# Altium project EMG_shield.PrjPcb
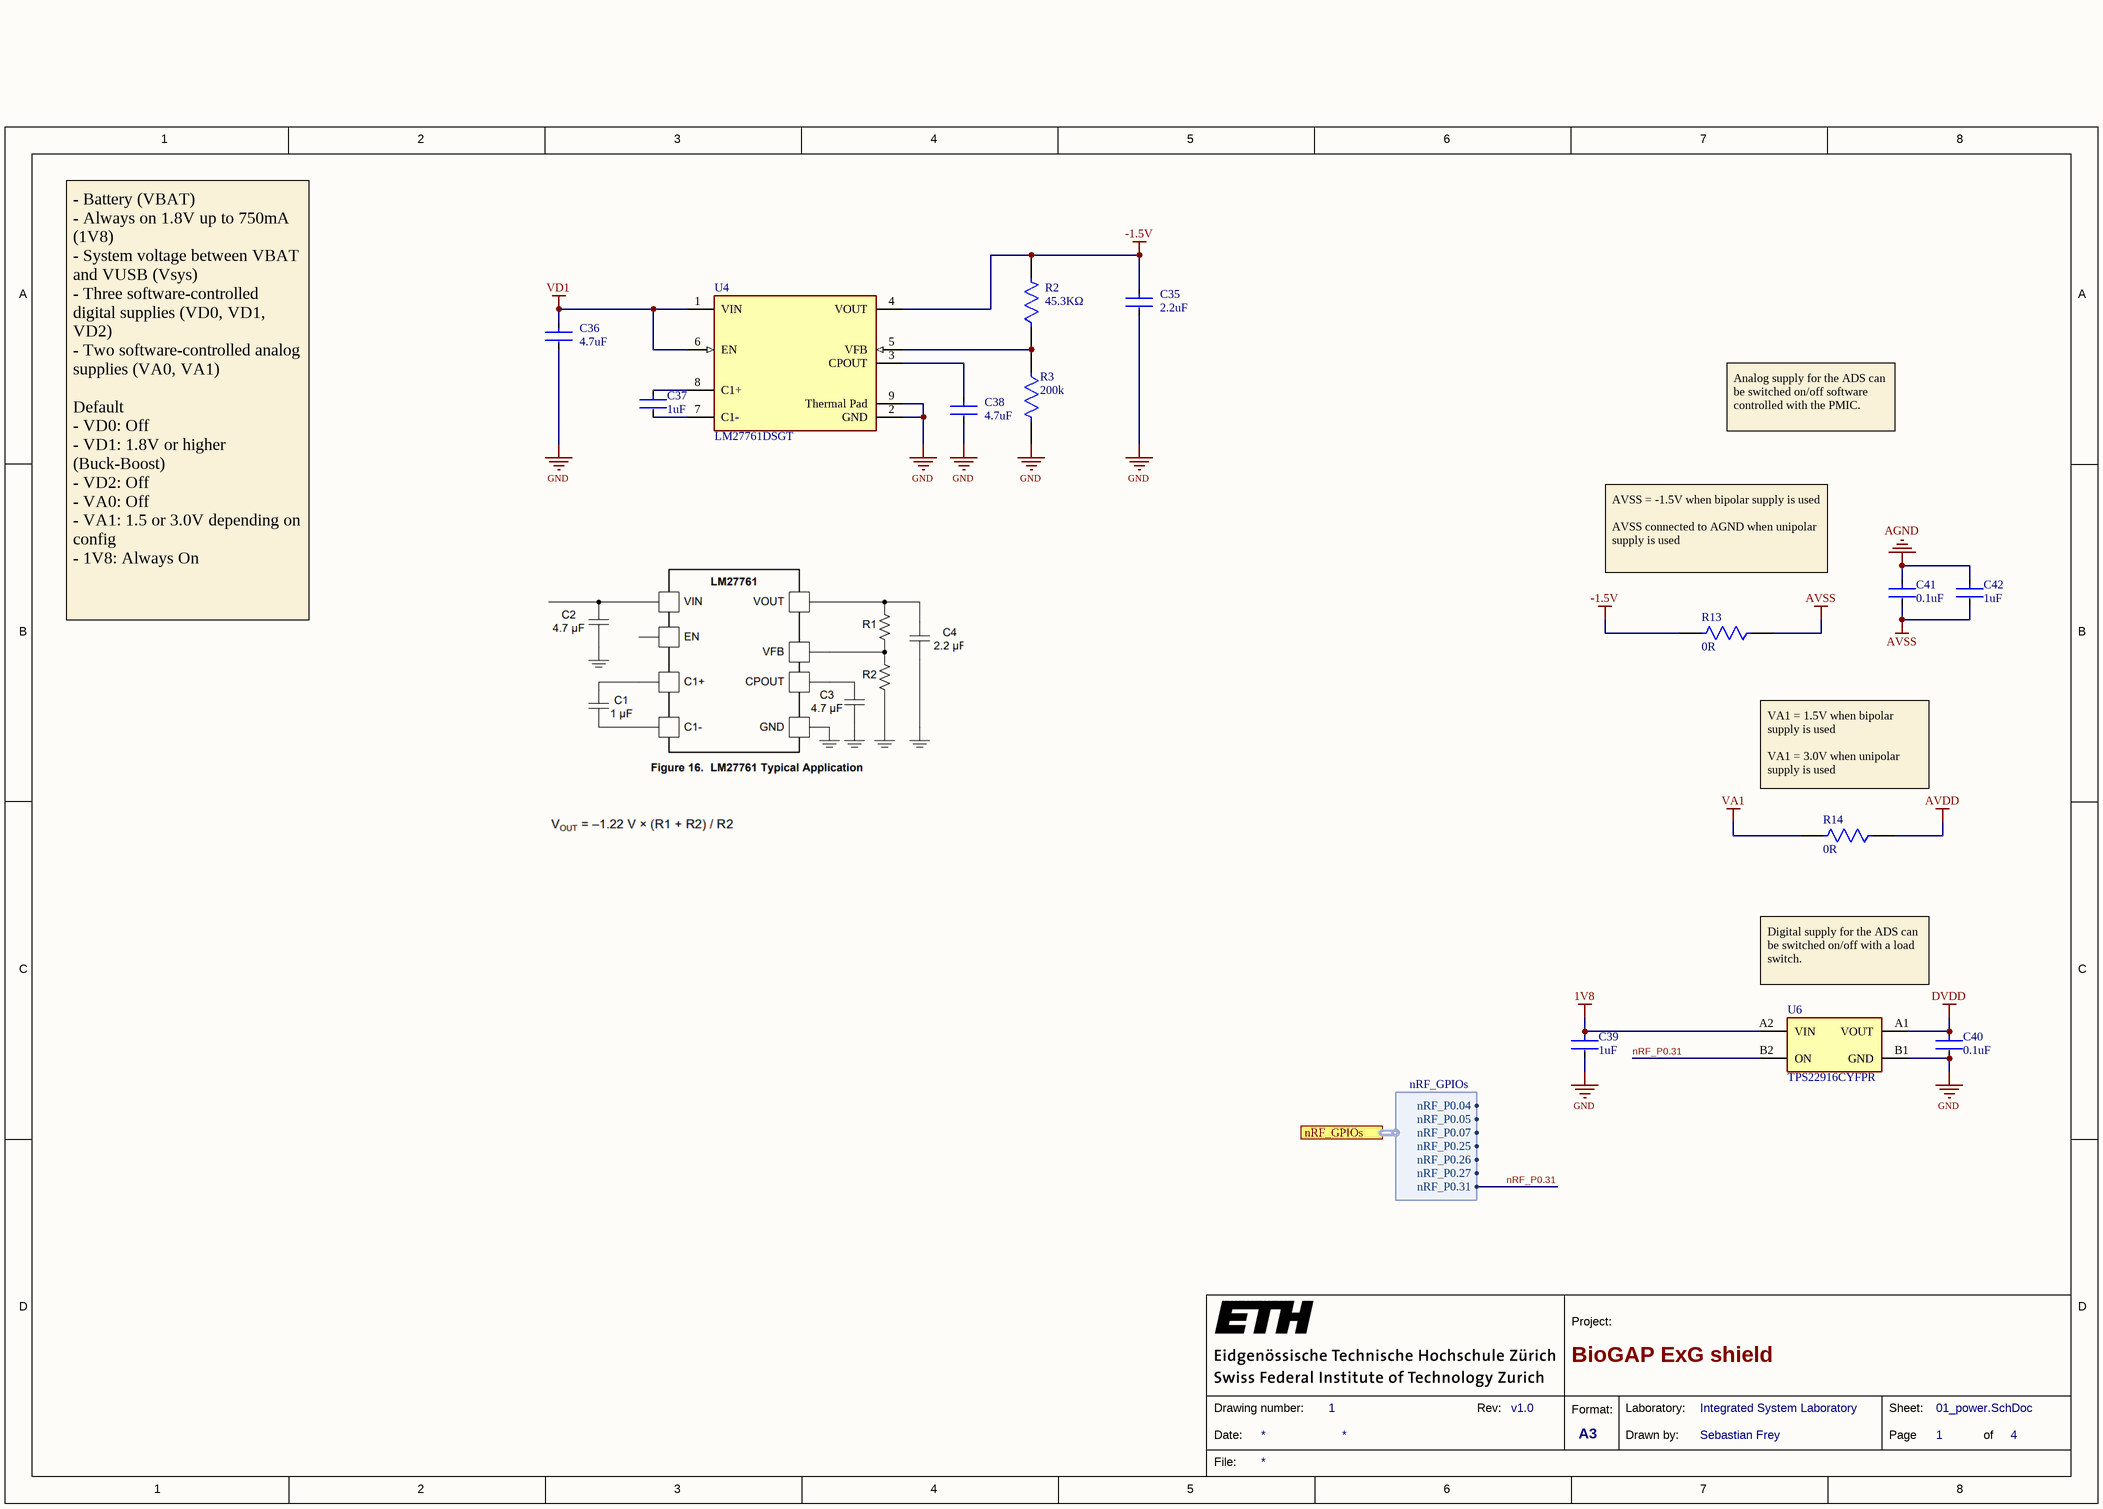
[diagram p0: 01_power.SchDoc]
revision: v2.0; title: BioGAP EMG shield
4 sheets, 130 parts. Net scope: flat (ports and power ports of the same name join across sheets).
Board file: EMG_shield.PcbDoc
Sheets:
  01_power.SchDoc
  02_AFE.SchDoc
  04_gap_interface.SchDoc
  03_electrode_interface_new.SchDoc

## Sheet 01_power.SchDoc: BioGAP ExG shield
size A3; Author: Sebastian Frey; DrawnBy: Sebastian Frey; Engineer: Sebastian Frey; Organization: Integrated System Laboratory; DocumentNumber: 1; Revision: v1.0; SheetNumber: 1; SheetTotal: 4

### Parts
C35  Capacitance: 2.2uF  [FP-GRM155-0_15-IPC_B]  (hidden comment: GRM155Z71A225KE01D)
C36  Capacitance: 4.7uF  [FP-CL282-IPC_C]  (hidden comment: CL05A475MP5NRNC)
C37  Capacitance: 1uF  [FP-CL511-IPC_C]  (hidden comment: CL05A105KP5NNNC)
C38  Capacitance: 4.7uF  [FP-CL282-IPC_C]  (hidden comment: CL05A475MP5NRNC)
C39  Capacitance: 1uF  [FP-CL511-IPC_C]  (hidden comment: CL05A105KP5NNNC)
C40  Capacitance: 0.1uF  [FP-CL278-IPC_C]  (hidden comment: CL05A104KA5NNNC)
C41  Capacitance: 0.1uF  [FP-CL278-IPC_C]  (hidden comment: CL05A104KA5NNNC)
C42  Capacitance: 1uF  [FP-CL511-IPC_C]  (hidden comment: CL05A105KP5NNNC)
R2  Resistance: 45.3KΩ  [FP-RT0402-MFG]  (hidden comment: RT0402BRD0745K3L)
R3  Resistance: 200k  [FP-RN73R1E-IPC_C]  (hidden comment: RN73R1ETTP2003B25)
R13  Resistance: 0R  [FP-RC0402-0_4-IPC_A]  (hidden comment: RC0402FR-070RL)
R14  Resistance: 0R  [FP-RC0402-0_4-IPC_A]  (hidden comment: RC0402FR-070RL)
U4  LM27761DSGT  [FP-DSG0008A-MFG]
U6  TPS22916CYFPR  [BGA4C40P2X2_78X78X50]

### Ports
nRF_GPIOs (harness nRF_GPIOs)

### Harnesses
nRF_GPIOs: nRF_P0.07, nRF_P0.25, nRF_P0.05, nRF_P0.04, nRF_P0.26, nRF_P0.27, nRF_P0.31

### Nets
1V8: C39.1 U6.A2(VIN)
-1.5V: C35.1 R2.2 R13.2 U4.4(VOUT)
AGND: C41.1 C42.1
AVDD: R14.1
AVSS: C41.2 C42.2 R13.1
DVDD: C40.1 U6.A1(VOUT)
GND: C35.2 C36.2 C38.2 C39.2 C40.2 R3.2 U4.2(GND) U4.9(Thermal_Pad) U6.B1(GND)
VA1: R14.2
VD1: C36.1 U4.1(VIN) U4.6(EN)
nRF_P0.31: U6.B2(ON) ; port nRF_GPIOs.nRF_P0.31
NetC37_1: C37.1 U4.8(C1+)
NetC37_2: C37.2 U4.7(C1-)
NetC38_1: C38.1 U4.3(CPOUT)
NetR2_1: R2.1 R3.1 U4.5(VFB)

### Notes on the sheet
- Analog supply for the ADS can be switched on/off software controlled with the PMIC.
- AVSS = -1.5V when bipolar supply is used
  AVSS connected to AGND when unipolar supply is used
- - Battery (VBAT)
  - Always on 1.8V up to 750mA (1V8)
  - System voltage between VBAT and VUSB (Vsys)
  - Three software-controlled digital supplies (VD0, VD1, VD2)
  - Two software-controlled analog supplies (VA0, VA1)
  Default
  - VD0: Off
  - VD1: 1.8V or higher (Buck-Boost)
  - VD2: Off
  - VA0: Off
  - VA1: 1.5 or 3.0V depending on config
  - 1V8: Always On
- VA1 = 1.5V when bipolar supply is used
  VA1 = 3.0V when unipolar supply is used
- Digital supply for the ADS can be switched on/off with a load switch.
- 1
- 2
- 3
- 4
- 5
- 6
- 7
- 8
- A
- B
- C
- D
- Project:
- Date:
- Drawing number:
- Rev:
- Format:
- A3
- Drawn by:
- Laboratory:
- Page
- Sheet:
- of
- File:

### Library data of the parts
C35 = CMP-06035-048202-1: Chip Multilayer Ceramic Capacitors for General Purpose, 0402, 2.2uF, X7R, 15%, 10%, 10V; Value: 2.2uF
C36 C38 = CMP-13271-000548-1: Cap Ceramic 4.7uF 10V X5R ±20% SMD 0402 +85°C Paper T/R; Max Operating Temperature: 85°C; Lead Free: Lead Free; Tolerance: 20%; Voltage Rating: 10V; Dielectric: X5R; Width: 0.02inch; Length: 0.039inch; Case/Package: 0402; Min Operating Temperature: -55°C; Packaging: Tape and Reel; Thickness: 0.022inch; Case Code (Imperial): 0402; Package Quantity: 10000; Case Code (Metric): 1005; Mount: Surface Mount; Value: 4.7uF
C37 C39 C42 = CMP-13271-001936-1: Cap Ceramic 1uF 10V X5R ±10% SMD 0402 +85°C Paper T/R; Depth: 0.5mm; Case Code (Imperial): 0402; Material: Ceramic; Mount: Surface Mount; Thickness: 0.022inch; Dielectric: X5R; Radiation Hardening: No; Case/Package: 0402; Length: 1mm; Tolerance: 10%; Max Operating Temperature: 85°C; Package Quantity: 1; Width: 0.02inch; Voltage Rating: 10V; Contact Plating: Tin; Height: 0.5mm; Min Operating Temperature: -55°C; Case Code (Metric): 1005; Packaging: Tape and Reel; Value: 1uF
C40 C41 = CMP-13271-000728-1: Cap Ceramic 100nF 25V X5R ±10% SMD 0402 +85°C Paper T/R; Value: 0.1uF; Package Quantity: 1; Height: 0.5mm; Case Code (Metric): 1005; Thickness: 0.022inch; Mount: Surface Mount; Lead Free: Lead Free; Case Code (Imperial): 0402; Packaging: Tape and Reel; Depth: 0.5mm; Voltage: 25V; Min Operating Temperature: -55°C; Voltage Rating: 25V; Dielectric: X5R; Case/Package: 0402; Tolerance: 10%; Width: 0.02inch; Max Operating Temperature: 85°C; Length: 1mm; Radiation Hardening: No; Voltage Rating (DC): 25V
R2 = CMP-03412-018483-1: RES 45.3K OHM 1/16W .1% SMD 0402; Manufacturer: Yageo; Value: 45.3KΩ; Voltage Rating: 50V; Temperature Coefficient: 25 ppm/°C; Power Rating: 0.063W; Tolerance: 0.001; Device Class L1: Passive Components; Digikey Description: RES 45.3K OHM 1/16W .1% SMD 0402; Package: RT0402; Composition: Thin Film; Series: RT; ComponentLink2Description: Datasheet; Category: Res; Temperature Range Low: -55°C; Footprint Url: http://www.yageo.com/exep/pages/download/literatures/PYu-R_Mount_10.pdf; Temperature Range High: +155°C; RoHS: TRUE; Lead Free: Yes; Mouser Description: Thin Film Resistors 1/16W 45.3K ohm .1% 25ppm; Temperature: -55°C to +155°C; Device Class L2: Resistors; Manufacturer Part Number: RT0402BRD0745K3L; Ipc Land Pattern Name: RESC10050X30; Automotive: No; ComponentLink2URL: http://www.yageo.com/documents/recent/PYu-RT_1-to-0.01_RoHS_L_9.pdf; Device Class L3: Chip SMD Resistors; Height: 0.35mm; Octopart: https://octopart.com/rt0402brd0745k3l-yageo-1472491
R3 = CMP-04015-050624-1: 200kΩ ±0.1% 0.063W, 1/16W Chip Resistor 0402 (1005 Metric) Moisture Resistant Thin Film; Value: 200k
R13 R14 = CMP-2002-07342-2: RES SMD 0 OHM JUMPER 1/16W 0402; Temperature Coefficient: 200ppm/°C; Tolerance: 1%; Power Rating: 62.5mW; Voltage Rating: 50V; Max Power Dissipation: 63mW; Value: 0R; Features: Moisture Resistant; Length: 1mm; Case Code (Metric): 1005; Series: RC; RoHS Compliant: Yes; Resistor Type: Thick Film; Height: 0.35mm; Min Operating Temperature: -55°C; Case Code (Imperial): 0402; Number of Terminations: 2; Contact Plating: Tin; Case/Package: 0402; Size Code: 0402; Termination: SMD/SMT; Max Operating Temperature: 155°C; Width: 0.5mm; Mount: Surface Mount; Lead Free: Lead Free; Packaging: Tape and Reel; Radiation Hardening: No
U4 = CMP-04918-000089-1: IC REG CHARGE PUMP ADJ 8WSON; Manufacturer: Texas Instruments; Output Voltage: -5-1.5V; Nominal Supply Current: 370uA; Number Of Outputs: 1; Negative Voltage Available: true; Output Current: 250mA; Min Supply Voltage: 2.7V; Standoff Height: 0mm; Output Type: AdjustableProgrammable; Switching Frequency: 2MHz; Max Supply Voltage: 5.5V; Max Junction Temp: +125°C; Switching Topology: Charge Pump; Package: DSG0008A; Device Class L2: Power Management ICs; ComponentLink2Description: Datasheet; Temperature: -40°C to +85°C; Automotive: No; Temperature Range High: +85°C; Lead Free: Yes; Temperature Range Low: -40°C; RoHS: TRUE; Digikey Description: IC REG CHARGE PUMP ADJ 8WSON; ComponentLink2URL: http://www.ti.com/lit/ds/symlink/lm27761.pdf; Manufacturer Part Number: LM27761DSGT; Height: 0.8mm; Device Class L1: Integrated Circuits (ICs); Category: IC; Octopart: https://octopart.com/lm27761dsgt-texas+instruments-66646294; Mouser Description: Switching Voltage Regulators Low-Noise Regulated Switched Capacitor; Ambient Temperature Range Low: -40°C; Device Class L3: Voltage Regulators - Switching; Ambient Temperature Range High: +85°C
U6 = TPS22916CYFPR: Integrated Circuit; Manufacturer_Name: Texas Instruments; Datasheet Link: http://www.ti.com/lit/gpn/tps22916; Height: 0.5mm; Manufacturer_Part_Number: TPS22916CYFPR; Mouser Part Number: 595-TPS22916CYFPR; Mouser Price/Stock: https://www.mouser.co.uk/ProductDetail/Texas-Instruments/TPS22916CYFPR?qs=EU6FO9ffTweddKR4NsfVQg%3D%3D; Arrow Part Number: TPS22916CYFPR; Arrow Price/Stock: https://www.arrow.com/en/products/tps22916cyfpr/texas-instruments?region=nac

## Sheet 02_AFE.SchDoc: BioGAP ExG shield
size A3; Author: Sebastian Frey; DrawnBy: Sebastian Frey; Engineer: Sebastian Frey; Organization: Integrated System Laboratory; DocumentNumber: 2; Revision: v1.0; SheetNumber: 2; SheetTotal: 4
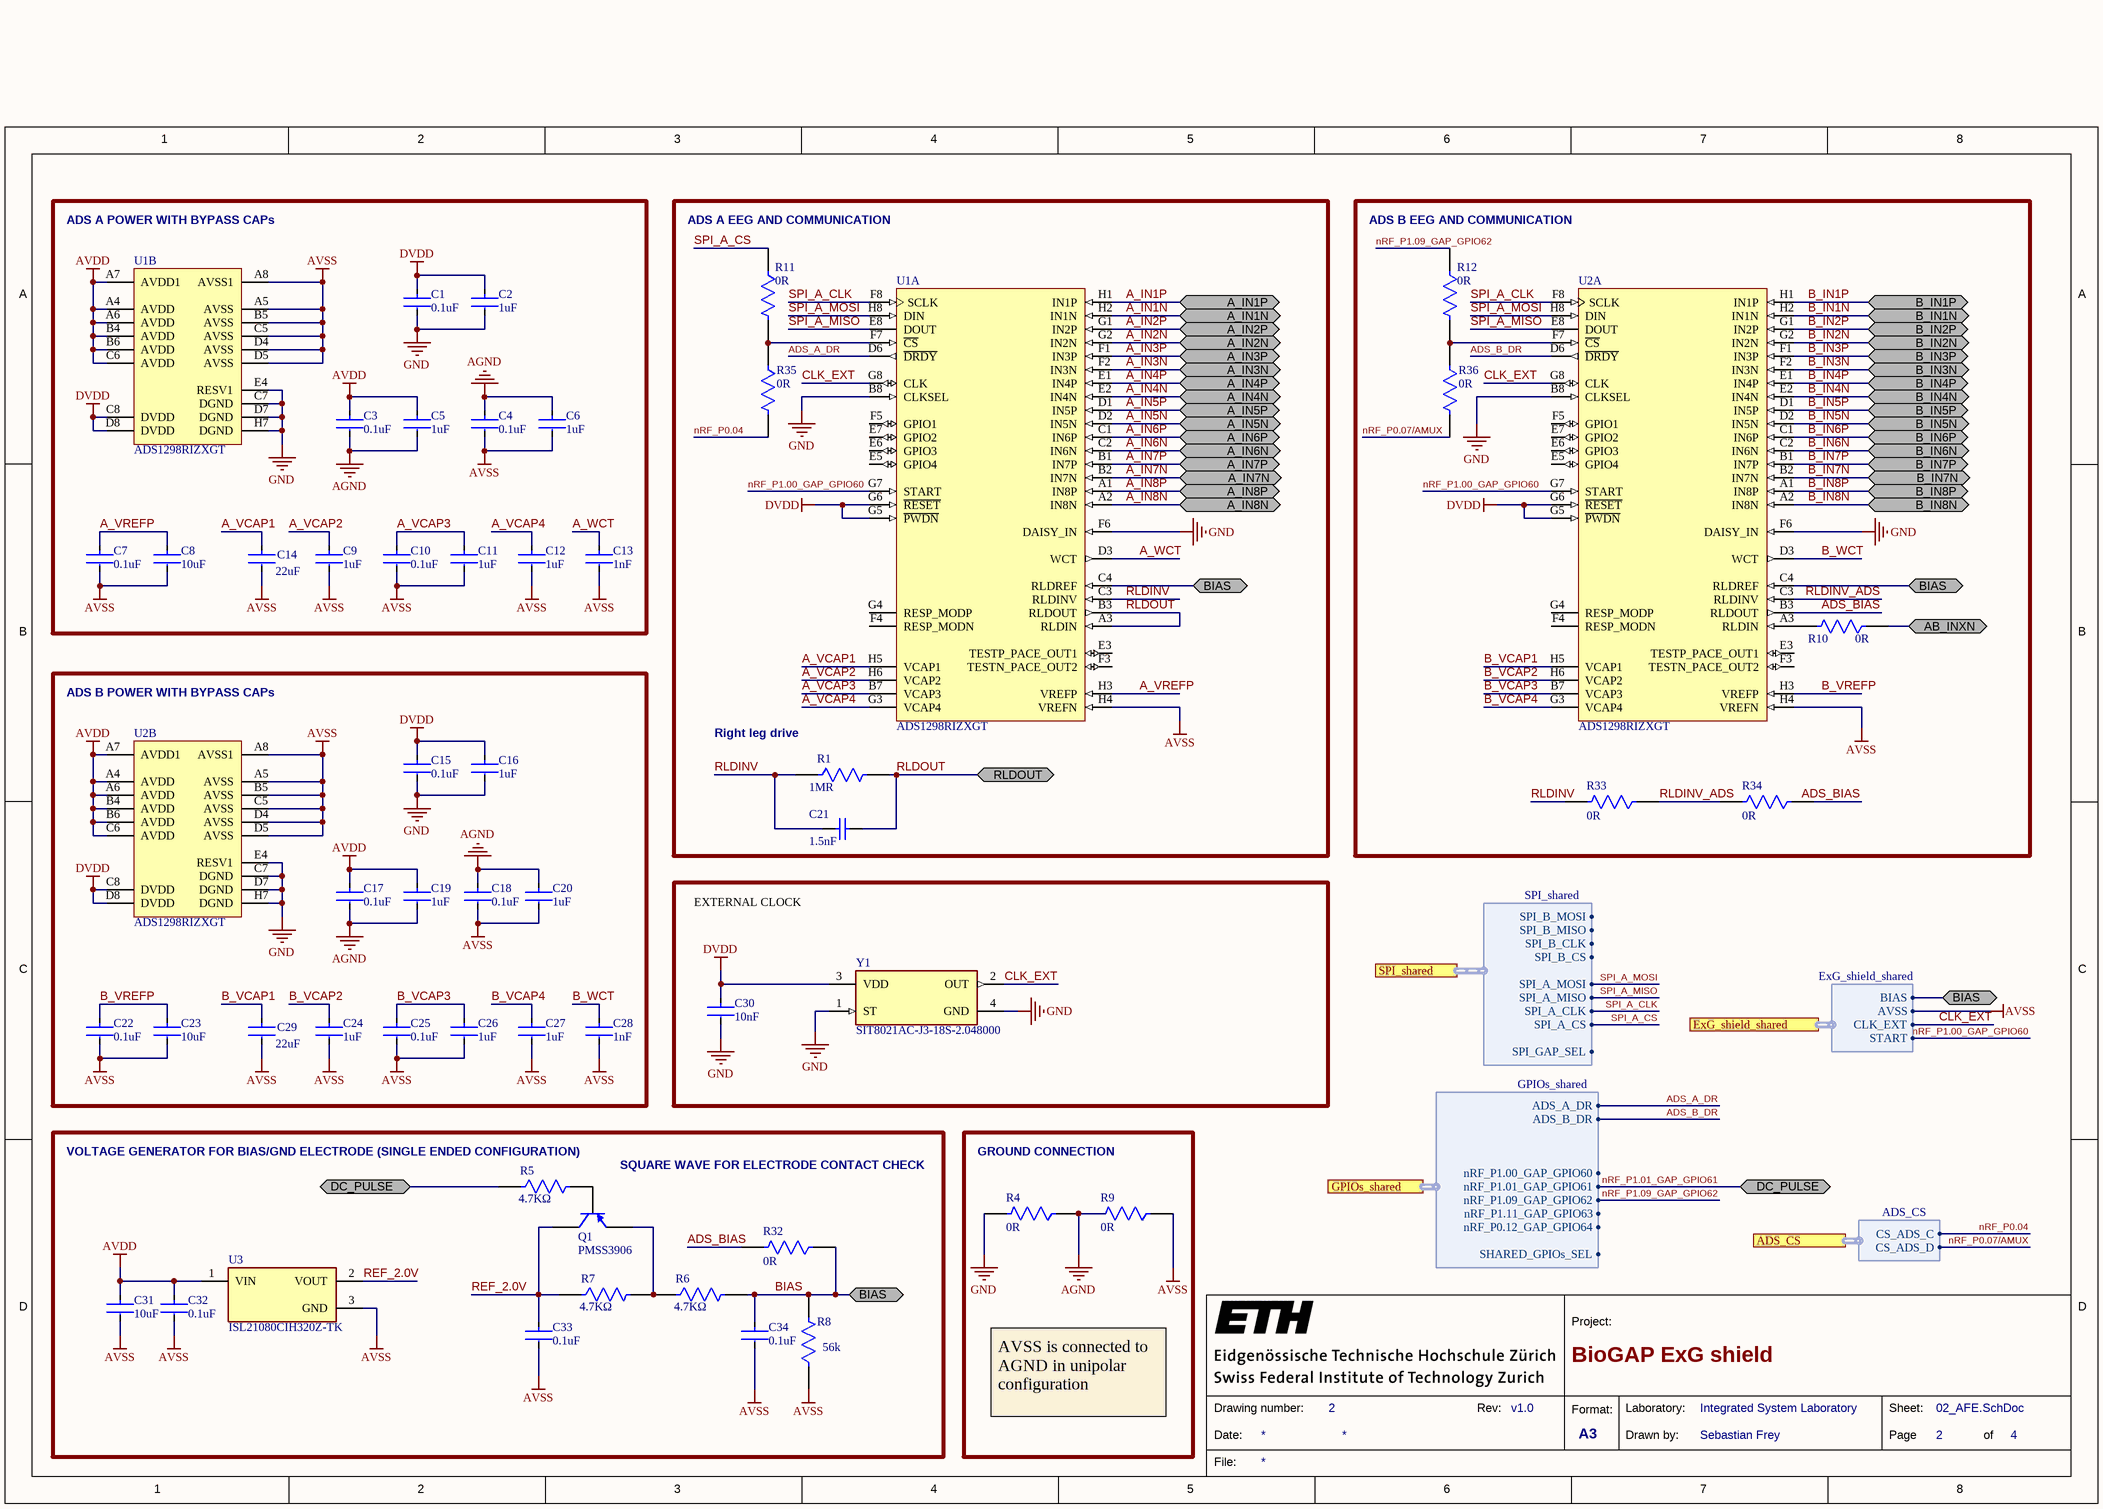
[diagram p1: 02_AFE.SchDoc]

### Parts
C1  Capacitance: 0.1uF  [FP-CL278-IPC_C]  (hidden comment: CL05A104KA5NNNC)
C2  Capacitance: 1uF  [FP-CL511-IPC_C]  (hidden comment: CL05A105KP5NNNC)
C3  Capacitance: 0.1uF  [FP-CL278-IPC_C]  (hidden comment: CL05A104KA5NNNC)
C4  Capacitance: 0.1uF  [FP-CL278-IPC_C]  (hidden comment: CL05A104KA5NNNC)
C5  Capacitance: 1uF  [FP-CL511-IPC_C]  (hidden comment: CL05A105KP5NNNC)
C6  Capacitance: 1uF  [FP-CL511-IPC_C]  (hidden comment: CL05A105KP5NNNC)
C7  Capacitance: 0.1uF  [FP-CL278-IPC_C]  (hidden comment: CL05A104KA5NNNC)
C8  Capacitance: 10uF  [FP-CL07-IPC_C]  (hidden comment: CL05A106MP8NUB8)
C9  Capacitance: 1uF  [FP-CL511-IPC_C]  (hidden comment: CL05A105KP5NNNC)
C10  Capacitance: 0.1uF  [FP-CL278-IPC_C]  (hidden comment: CL05A104KA5NNNC)
C11  Capacitance: 1uF  [FP-CL511-IPC_C]  (hidden comment: CL05A105KP5NNNC)
C12  Capacitance: 1uF  [FP-CL511-IPC_C]  (hidden comment: CL05A105KP5NNNC)
C13  Capacitance: 1nF  [FP-0402-L_1_0_1-W_0_5_0_1-IPC_B]  (hidden comment: 04025C102KAT2A)
C14  Capacitance: 22uF  [FP-CL746-IPC_C]  (hidden comment: CL05A226MQ5QUNC)
C15  Capacitance: 0.1uF  [FP-CL278-IPC_C]  (hidden comment: CL05A104KA5NNNC)
C16  Capacitance: 1uF  [FP-CL511-IPC_C]  (hidden comment: CL05A105KP5NNNC)
C17  Capacitance: 0.1uF  [FP-CL278-IPC_C]  (hidden comment: CL05A104KA5NNNC)
C18  Capacitance: 0.1uF  [FP-CL278-IPC_C]  (hidden comment: CL05A104KA5NNNC)
C19  Capacitance: 1uF  [FP-CL511-IPC_C]  (hidden comment: CL05A105KP5NNNC)
C20  Capacitance: 1uF  [FP-CL511-IPC_C]  (hidden comment: CL05A105KP5NNNC)
C21  Capacitance: 1.5nF  [CAPC1005X55X25NL05T10]  (hidden comment: GRM155R71H152KA01D)
C22  Capacitance: 0.1uF  [FP-CL278-IPC_C]  (hidden comment: CL05A104KA5NNNC)
C23  Capacitance: 10uF  [FP-CL07-IPC_C]  (hidden comment: CL05A106MP8NUB8)
C24  Capacitance: 1uF  [FP-CL511-IPC_C]  (hidden comment: CL05A105KP5NNNC)
C25  Capacitance: 0.1uF  [FP-CL278-IPC_C]  (hidden comment: CL05A104KA5NNNC)
C26  Capacitance: 1uF  [FP-CL511-IPC_C]  (hidden comment: CL05A105KP5NNNC)
C27  Capacitance: 1uF  [FP-CL511-IPC_C]  (hidden comment: CL05A105KP5NNNC)
C28  Capacitance: 1nF  [FP-0402-L_1_0_1-W_0_5_0_1-IPC_B]  (hidden comment: 04025C102KAT2A)
C29  Capacitance: 22uF  [FP-CL746-IPC_C]  (hidden comment: CL05A226MQ5QUNC)
C30  Capacitance: 10nF  [FP-CGA2B-MFG]  (hidden comment: CGA2B3X7R1V103K050BB)
C31  Capacitance: 10uF  [FP-CL07-IPC_C]  (hidden comment: CL05A106MP8NUB8)
C32  Capacitance: 0.1uF  [FP-CL278-IPC_C]  (hidden comment: CL05A104KA5NNNC)
C33  Capacitance: 0.1uF  [FP-CL278-IPC_C]  (hidden comment: CL05A104KA5NNNC)
C34  Capacitance: 0.1uF  [FP-CL278-IPC_C]  (hidden comment: CL05A104KA5NNNC)
Q1  PMSS3906  [SOT323_N]
R1  Resistance: 1MR  [FP-MCS0402-IPC_C]  (hidden comment: MCS04020C1004FE000)
R4  Resistance: 0R  [FP-RC0402-0_4-IPC_A]  (hidden comment: RC0402FR-070RL)
R5  value 4.7KΩ  [FP-RT0402-MFG]  (hidden comment: RT0402FRE074K7L)
R6  value 4.7KΩ  [FP-RT0402-MFG]  (hidden comment: RT0402FRE074K7L)
R7  value 4.7KΩ  [FP-RT0402-MFG]  (hidden comment: RT0402FRE074K7L)
R8  Resistance: 56k  [FP-RR0510-MFG]  (hidden comment: RR0510P-563-D)
R9  Resistance: 0R  [FP-RC0402-0_4-IPC_A]  (hidden comment: RC0402FR-070RL)
R10  Resistance: 0R  [FP-RC0402-0_4-IPC_C]  (hidden comment: RC0402FR-070RL)
R11  Resistance: 0R  [FP-RC0402-0_4-IPC_C]  (hidden comment: RC0402FR-070RL)
R12  Resistance: 0R  [FP-RC0402-0_4-IPC_C]  (hidden comment: RC0402FR-070RL)
R32  Resistance: 0R  [FP-RC0402-0_4-IPC_C]  (hidden comment: RC0402FR-070RL)
R33  Resistance: 0R  [FP-RC0402-0_4-IPC_C]  (hidden comment: RC0402FR-070RL)
R34  Resistance: 0R  [FP-RC0402-0_4-IPC_C]  (hidden comment: RC0402FR-070RL)
R35  Resistance: 0R  [FP-RC0402-0_4-IPC_C]  (hidden comment: RC0402FR-070RL)
R36  Resistance: 0R  [FP-RC0402-0_4-IPC_C]  (hidden comment: RC0402FR-070RL)
U1  ADS1298RIZXGT  [TI-ZXG64]  (parts A,B of 2)
U2  ADS1298RIZXGT  [TI-ZXG64]  (parts A,B of 2)
U3  ISL21080CIH320Z-TK  [FP-P3_064A-IPC_C]
Y1  SIT8021AC-J3-18S-2.048000  [FP-SiT8021-MFG]

### Blocks framed on the sheet
ADS A POWER WITH BYPASS CAPs: C1-C14 U1
ADS B EEG AND COMMUNICATION: R10 R12 R33 R34 R36 U2
ADS B POWER WITH BYPASS CAPs: C15-C20 C22-C29 U2
SQUARE WAVE FOR ELECTRODE CONTACT CHECK: C31-C34 Q1 R5-R8 R32 U3
GROUND CONNECTION: R4 R9

### Ports
A_IN1N (bidir), A_IN1P (bidir), A_IN2N (bidir), A_IN2P (bidir), A_IN3N (bidir), A_IN3P (bidir), A_IN4N (bidir), A_IN4P (bidir), A_IN5N (bidir), A_IN5P (bidir), A_IN6N (bidir), A_IN6P (bidir), A_IN7N (bidir), A_IN7P (bidir), A_IN8N (bidir), A_IN8P (bidir), AB_INXN (bidir), ADS_CS (harness ADS_CS), B_IN1N (bidir), B_IN1P (bidir), B_IN2N (bidir), B_IN2P (bidir), B_IN3N (bidir), B_IN3P (bidir), B_IN4N (bidir), B_IN4P (bidir), B_IN5N (bidir), B_IN5P (bidir), B_IN6N (bidir), B_IN6P (bidir), B_IN7N (bidir), B_IN7P (bidir), B_IN8N (bidir), B_IN8P (bidir), BIAS (bidir), DC_PULSE (bidir), ExG_shield_shared (harness ExG_shield_shared), GPIOs_shared (harness GPIOs_shared), RLDOUT (bidir), SPI_shared (harness SPI_shared)

### Harnesses
SPI_shared: SPI_B_MOSI, SPI_B_MISO, SPI_B_CLK, SPI_B_CS, SPI_A_MOSI, SPI_A_MISO, SPI_A_CLK, SPI_A_CS, SPI_GAP_SEL
GPIOs_shared: ADS_A_DR, ADS_B_DR, nRF_P1.00_GAP_GPIO60, nRF_P1.09_GAP_GPIO62, nRF_P1.11_GAP_GPIO63, nRF_P0.12_GAP_GPIO64, SHARED_GPIOs_SEL, nRF_P1.01_GAP_GPIO61
ExG_shield_shared: BIAS, AVSS, CLK_EXT, START
ADS_CS: CS_ADS_C, CS_ADS_D

### Nets
AGND: C3.2 C4.1 C5.2 C6.1 C17.2 C18.1 C19.2 C20.1 R4.1 R9.2
AVDD: C3.1 C5.1 C17.1 C19.1 C31.1 C32.1 U1.A4(AVDD) U1.A6(AVDD) U1.A7(AVDD1) U1.B4(AVDD) U1.B6(AVDD) U1.C6(AVDD) U2.A4(AVDD) U2.A6(AVDD) U2.A7(AVDD1) U2.B4(AVDD) U2.B6(AVDD) U2.C6(AVDD) U3.1(VIN)
AVSS: C4.2 C6.2 C7.2 C8.2 C9.2 C10.2 C11.2 C12.2 C13.2 C14.2 C18.2 C20.2 C22.2 C23.2 C24.2 C25.2 C26.2 C27.2 C28.2 C29.2 C31.2 C32.2 C33.2 C34.2 R8.1 R9.1 U1.A5(AVSS) U1.A8(AVSS1) U1.B5(AVSS) U1.C5(AVSS) U1.D4(AVSS) U1.D5(AVSS) U1.H4(VREFN) U2.A5(AVSS) U2.A8(AVSS1) U2.B5(AVSS) U2.C5(AVSS) U2.D4(AVSS) U2.D5(AVSS) U2.H4(VREFN) U3.3(GND) ; port ExG_shield_shared.AVSS
DVDD: C1.1 C2.1 C15.1 C16.1 C30.1 U1.C8(DVDD) U1.D8(DVDD) U1.G5(~{PWDN}) U1.G6(~{RESET}) U2.C8(DVDD) U2.D8(DVDD) U2.G5(~{PWDN}) U2.G6(~{RESET}) Y1.3(VDD)
GND: C1.2 C2.2 C15.2 C16.2 C30.2 R4.2 U1.B8(CLKSEL) U1.C7(DGND) U1.D7(DGND) U1.E4(RESV1) U1.F6(DAISY_IN) U1.H7(DGND) U2.B8(CLKSEL) U2.C7(DGND) U2.D7(DGND) U2.E4(RESV1) U2.F6(DAISY_IN) U2.H7(DGND) Y1.1(ST) Y1.4(GND)
A_IN1N: U1.H2(IN1N) ; port A_IN1N
A_IN1P: U1.H1(IN1P) ; port A_IN1P
A_IN2N: U1.G2(IN2N) ; port A_IN2N
A_IN2P: U1.G1(IN2P) ; port A_IN2P
A_IN3N: U1.F2(IN3N) ; port A_IN3N
A_IN3P: U1.F1(IN3P) ; port A_IN3P
A_IN4N: U1.E2(IN4N) ; port A_IN4N
A_IN4P: U1.E1(IN4P) ; port A_IN4P
A_IN5N: U1.D2(IN5N) ; port A_IN5N
A_IN5P: U1.D1(IN5P) ; port A_IN5P
A_IN6N: U1.C2(IN6N) ; port A_IN6N
A_IN6P: U1.C1(IN6P) ; port A_IN6P
A_IN7N: U1.B2(IN7N) ; port A_IN7N
A_IN7P: U1.B1(IN7P) ; port A_IN7P
A_IN8N: U1.A2(IN8N) ; port A_IN8N
A_IN8P: U1.A1(IN8P) ; port A_IN8P
A_VCAP1: C14.1 U1.H5(VCAP1)
A_VCAP2: C9.1 U1.H6(VCAP2)
A_VCAP3: C10.1 C11.1 U1.B7(VCAP3)
A_VCAP4: C12.1 U1.G3(VCAP4)
A_VREFP: C7.1 C8.1 U1.H3(VREFP)
A_WCT: C13.1 U1.D3(WCT)
ADS_A_DR: U1.D6(~{DRDY}) ; port GPIOs_shared.ADS_A_DR
ADS_B_DR: U2.D6(~{DRDY}) ; port GPIOs_shared.ADS_B_DR
ADS_BIAS: R32.2 R34.1 U2.B3(RLDOUT)
B_IN1N: U2.H2(IN1N) ; port B_IN1N
B_IN1P: U2.H1(IN1P) ; port B_IN1P
B_IN2N: U2.G2(IN2N) ; port B_IN2N
B_IN2P: U2.G1(IN2P) ; port B_IN2P
B_IN3N: U2.F2(IN3N) ; port B_IN3N
B_IN3P: U2.F1(IN3P) ; port B_IN3P
B_IN4N: U2.E2(IN4N) ; port B_IN4N
B_IN4P: U2.E1(IN4P) ; port B_IN4P
B_IN5N: U2.D2(IN5N) ; port B_IN5N
B_IN5P: U2.D1(IN5P) ; port B_IN5P
B_IN6N: U2.C2(IN6N) ; port B_IN6N
B_IN6P: U2.C1(IN6P) ; port B_IN6P
B_IN7N: U2.B2(IN7N) ; port B_IN7N
B_IN7P: U2.B1(IN7P) ; port B_IN7P
B_IN8N: U2.A2(IN8N) ; port B_IN8N
B_IN8P: U2.A1(IN8P) ; port B_IN8P
B_VCAP1: C29.1 U2.H5(VCAP1)
B_VCAP2: C24.1 U2.H6(VCAP2)
B_VCAP3: C25.1 C26.1 U2.B7(VCAP3)
B_VCAP4: C27.1 U2.G3(VCAP4)
B_VREFP: C22.1 C23.1 U2.H3(VREFP)
B_WCT: C28.1 U2.D3(WCT)
BIAS: C34.1 R6.2 R8.2 R32.1 U1.C4(RLDREF) U2.C4(RLDREF) ; port BIAS, port ExG_shield_shared.BIAS
CLK_EXT: U1.G8(CLK) U2.G8(CLK) Y1.2(OUT) ; port ExG_shield_shared.CLK_EXT
nRF_P0.04: R35.2 ; port ADS_CS.CS_ADS_C
nRF_P0.07/AMUX: R36.2 ; port ADS_CS.CS_ADS_D
nRF_P1.00_GAP_GPIO60: U1.G7(START) U2.G7(START) ; port GPIOs_shared.nRF_P1.00_GAP_GPIO60, port ExG_shield_shared.START
nRF_P1.01_GAP_GPIO61: R5.1 ; port DC_PULSE, port GPIOs_shared.nRF_P1.01_GAP_GPIO61
nRF_P1.09_GAP_GPIO62: R12.1 ; port GPIOs_shared.nRF_P1.09_GAP_GPIO62
REF_2.0V: C33.1 Q1.3(C) R7.1 U3.2(VOUT)
RLDINV: C21.1 R1.1 R33.2 U1.C3(RLDINV)
RLDINV_ADS: R33.1 R34.2 U2.C3(RLDINV)
RLDOUT: C21.2 R1.2 U1.A3(RLDIN) U1.B3(RLDOUT) ; port RLDOUT
SPI_A_CLK: U1.F8(SCLK) U2.F8(SCLK) ; port SPI_shared.SPI_A_CLK
SPI_A_CS: R11.1 ; port SPI_shared.SPI_A_CS
SPI_A_MISO: U1.E8(DOUT) U2.E8(DOUT) ; port SPI_shared.SPI_A_MISO
SPI_A_MOSI: U1.H8(DIN) U2.H8(DIN) ; port SPI_shared.SPI_A_MOSI
NetJ24_43: R10.1 ; port AB_INXN
NetQ1_1: Q1.1(B) R5.2
NetQ1_2: Q1.2(E) R6.1 R7.2
NetR10_2: R10.2 U2.A3(RLDIN)
NetR11_2: R11.2 R35.1 U1.F7(~{CS})
NetR12_2: R12.2 R36.1 U2.F7(~{CS})

Not connected (* = marked no-connect by the designer): U1 E3(TESTP_PACE_OUT1) E5(GPIO4) E6(GPIO3) E7(GPIO2) F3(TESTN_PACE_OUT2) F4(RESP_MODN) F5(GPIO1) G4(RESP_MODP); U2 E3(TESTP_PACE_OUT1) E5(GPIO4) E6(GPIO3) E7(GPIO2) F3(TESTN_PACE_OUT2) F4(RESP_MODN) F5(GPIO1) G4(RESP_MODP)

### Notes on the sheet
- (near R11) ADS A EEG AND COMMUNICATION
- (near R1) Right leg drive
- EXTERNAL CLOCK
- (near R5) VOLTAGE GENERATOR FOR BIAS/GND ELECTRODE (SINGLE ENDED CONFIGURATION)
- AVSS is connected to AGND in unipolar configuration
- 1
- 2
- 3
- 4
- 5
- 6
- 7
- 8
- A
- B
- C
- D
- Project:
- Date:
- Drawing number:
- Rev:
- Format:
- A3
- Drawn by:
- Laboratory:
- Page
- Sheet:
- of
- File:

### Library data of the parts
C1 C3 C4 C7 C10 C15 C17 C18 C22 C25 C32-C34 = CMP-13271-000728-1: as C40 on sheet 01_power; Package Quantity: 1; Height: 0.5mm; Case Code (Metric): 1005; Thickness: 0.022inch; Mount: Surface Mount; Lead Free: Lead Free; Case Code (Imperial): 0402; Packaging: Tape and Reel; Depth: 0.5mm; Voltage: 25V; Min Operating Temperature: -55°C; Voltage Rating: 25V; Dielectric: X5R; Case/Package: 0402; Tolerance: 10%; Width: 0.02inch; Max Operating Temperature: 85°C; Length: 1mm; Radiation Hardening: No; Voltage Rating (DC): 25V
C2 C5 C6 C9 C11 C12 C16 C19 C20 C24 C26 C27 = CMP-13271-001936-1: as C37 on sheet 01_power; Depth: 0.5mm; Case Code (Imperial): 0402; Material: Ceramic; Mount: Surface Mount; Thickness: 0.022inch; Dielectric: X5R; Radiation Hardening: No; Case/Package: 0402; Length: 1mm; Tolerance: 10%; Max Operating Temperature: 85°C; Package Quantity: 1; Width: 0.02inch; Voltage Rating: 10V; Contact Plating: Tin; Height: 0.5mm; Min Operating Temperature: -55°C; Case Code (Metric): 1005; Packaging: Tape and Reel; Value: 1uF
C8 C23 C31 = CMP-13271-002778-1: Cap Ceramic 10uF 10V X5R ±20% SMD 0402 +85°C Paper T/R; Length: 0.039inch; Mount: Surface Mount; Case Code (Imperial): 0402; Max Operating Temperature: 85°C; Voltage Rating: 10V; Min Operating Temperature: -55°C; Case/Package: 0402; Thickness: 0.035inch; Width: 0.02inch; Case Code (Metric): 1005; Packaging: Tape and Reel; Tolerance: 20%; Value: 10uF
C13 C28 = CMP-2008-02699-2: General Purpose Ceramic Capacitor, 0402, 1nF, 10%, X7R, 15%, 50V; Insulation Resistance: 100GR; Dissipation Factor: 2.5%; Series: -; RoHS Compliant: Yes; Length: 1mm; Tolerance: 10%; Thickness: 0.022inch; Packaging: Tape and Reel; Voltage: 50V; Voltage Rating: 50V; Dielectric: X7R; Case Code (Imperial): 0402; Number of Pins: 2; Case/Package: 0402; Radiation Hardening: No; Width: 0.02inch; Depth: 0.5mm; REACH SVHC: No SVHC; Min Operating Temperature: -55°C; Termination: SMD/SMT; Voltage Rating (DC): 50V; Mount: Surface Mount; Construction: Flat; Case Code (Metric): 1005; Max Operating Temperature: 125°C; Lead Free: Lead Free; Package Quantity: 1; Contact Plating: Tin; Height: 0.56mm; Value: 1nF
C14 C29 = CMP-13271-000286-1: Cap Ceramic 22uF 6.3V X5R ±20% SMD 0402 +85°C Paper T/R; Case Code (Imperial): 0402; Tolerance: 20%; Width: 0.02inch; Packaging: Tape and Reel; Case/Package: 0402; Min Operating Temperature: -55°C; Max Operating Temperature: 85°C; Voltage Rating: 6.3V; Thickness: 0.022inch; Mount: Surface Mount; Length: 0.039inch; Case Code (Metric): 1005; Value: 22uF
C21 = CMP-2008-04642-1: Manufacturer: Murata; Value: 1.5nF; Part Number: GRM155R71H152KA01D
C30 = CMP-08246-000497-1: Cap Ceramic 10nF 35V X7R 10% Pad SMD 0402 +125°C Automotive T/R; Packaging: Tape and Reel; Case Code (Metric): 1005; Max Operating Temperature: 125°C; Case Code (Imperial): 0402; Voltage Rating (DC): 35V; Min Operating Temperature: -55°C; Voltage Rating: 35V; Termination: SMD/SMT; Case/Package: 0402; Dielectric: X7R; Tolerance: 10%; Lead Free: Lead Free; Value: 10nF
Q1 = PMSS3906: PNP Switching Transistor; Published: 17-Sep-2003; LatestRevisionDate: 12-Dec-2006; LatestRevisionNote: IPC-7351 Footprint Added.; DatasheetVersion: 22-Apr-1999; PackageVersion: Apr-1999; PackageReference: SOT323; Publisher: Altium Limited; PackageDescription: 3-Pin SOT-323 Package 0.65 mm Pitch, 2.1 mm Lead Span; ComponentLink1Description: Manufacturer Link; ComponentLink1URL: http://www.semiconductors.philips.com/; ComponentLink2Description: Datasheet; ComponentLink2URL: http://www.semiconductors.philips.com/acrobat/datasheets/PMSS3906_4.pdf
R1 = CMP-02407-000443-1: RES SMD 1M OHM 1% 1/10W 0402; Voltage Rating (DC): 50V; Temperature Coefficient: 50ppm/°C; Power Rating: 63mW; Max Power Dissipation: 100mW; Value: 1MR; Radiation Hardening: No; Tolerance: 1%; Packaging: Tape and Reel; Case/Package: 0402; Case Code (Imperial): 0402; Width: 0.5mm; Lead Free: Lead Free; Composition: Thin Film; Mount: Surface Mount; Weight: 2.1E-05oz; Number of Terminations: 2; REACH SVHC: No SVHC; Depth: 0.5mm; Min Operating Temperature: -55°C; Height: 0.015inch; Max Operating Temperature: 125°C; Case Code (Metric): 1005; Package Quantity: 1; Military Standard: Not; Voltage Rating: 50V; Contact Plating: Tin; Length: 1mm
R4 R10-R12 R33 = CMP-2002-07342-2: as R13 on sheet 01_power; Features: Moisture Resistant; Length: 1mm; Case Code (Metric): 1005; Series: RC; RoHS Compliant: Yes; Resistor Type: Thick Film; Height: 0.35mm; Min Operating Temperature: -55°C; Case Code (Imperial): 0402; Number of Terminations: 2; Contact Plating: Tin; Case/Package: 0402; Size Code: 0402; Termination: SMD/SMT; Max Operating Temperature: 155°C; Width: 0.5mm; Mount: Surface Mount; Lead Free: Lead Free; Packaging: Tape and Reel; Radiation Hardening: No
R5-R7 = CMP-2002-02901-2: RES 4.70K OHM 1/16W 1% SMD 0402; Manufacturer: Yageo; Voltage Rating: 50V; Temperature Coefficient: 50 ppm/°C; Tolerance: 0.01; Power Rating: 0.063W; ComponentLink2URL: http://www.yageo.com/documents/recent/PYu-RT_1-to-0.01_RoHS_L_9.pdf; Temperature Range High: +155°C; Mouser Description: Res Thin Film 0402 4.7K Ohm 1% 1/16W ±50ppm/°C SMD Paper T/R; Temperature Range Low: -55°C; Device Class L1: Passive Components; Lead Free: Yes; Series: RT; Resistance: 4.7KΩ; Automotive: No; Manufacturer Part Number: RT0402FRE074K7L; Package: RT0402; Composition: Thin Film; RoHS: TRUE; ComponentLink2Description: Datasheet; Octopart: https://octopart.com/rt0402fre074k7l-yageo-1371922; Footprint Url: http://www.yageo.com/exep/pages/download/literatures/PYu-R_Mount_10.pdf; Height: 0.35mm; Category: Res; Device Class L3: Chip SMD Resistors; Temperature: -55°C to +155°C; Digikey Description: RES 4.70K OHM 1/16W 1% SMD 0402; Device Class L2: Resistors; Ipc Land Pattern Name: RESC10050X30
R8 = CMP-2002-01632-2: 56kΩ ±0.5% 0.0625W 1/16W Chip Resistor 0402 (1005 Metric) Thin Film; Max Power Dissipation: 63mW; Power Rating: 62.5mW; Temperature Coefficient: 25ppm/°C; Voltage Rating (DC): 25V; Value: 56k; Series: RR; RoHS Compliant: Yes; Termination: SMD/SMT; Number of Pins: 2; Min Operating Temperature: -55°C; Resistance Tolerance: 0.5%; Case/Package: 0402; Max Operating Temperature: 125°C; Resistor Type: Thin Film; Packaging: Tape and Reel; Case Code (Metric): 1005; Voltage Rating: 25V; Case Code (Imperial): 0402; Number of Terminations: 2; Size Code: 0402; Lead Free: Lead Free; Tolerance: 0.5%
R9 R32 R34-R36 = CMP-2002-07342-2: RES SMD 0 OHM JUMPER 1/16W 0402; Temperature Coefficient: 200ppm/°C; Tolerance: 1%; Power Rating: 62.5mW; Voltage Rating: 50V; Max Power Dissipation: 63mW; Features: Moisture Resistant; Length: 1mm; Case Code (Metric): 1005; Series: RC; RoHS Compliant: Yes; Resistor Type: Thick Film; Height: 0.35mm; Min Operating Temperature: -55°C; Case Code (Imperial): 0402; Number of Terminations: 2; Contact Plating: Tin; Case/Package: 0402; Size Code: 0402; Termination: SMD/SMT; Max Operating Temperature: 155°C; Width: 0.5mm; Mount: Surface Mount; Lead Free: Lead Free; Packaging: Tape and Reel; Radiation Hardening: No
U1 U2 = CMP-0003-00996-1: 8-Channel, 24-Bit ADC with Integrated Respiration Impedance and ECG Front End, -40 to 85 degC, 64-pin BGA (ZXG64), Green (RoHS & no Sb/Br); Manufacturer: Texas Instruments; SNR(dB): 112; Architecture: Delta-Sigma; # Input Channels: 8; Digital Supply(Max)(V): 3.6; SubFamily: Precision ADC (<=10MSPS); Interface: Serial SPI; Analog Voltage AV/DD(Min)(V): 2.7; Analog Voltage AV/DD(Max)(V): 5.25; Sample Rate (max)(SPS): 32K; Resolution(Bits): 24; Digital Supply(Min)(V): 1.65; ComponentLink1URL: http://www.ti.com/; PackageVersion: 4206838/A, 02/2005; Eco-Plan: Green (RoHS & no Sb/Br); ComponentLink2URL: http://www.ti.com/general/docs/lit/getliterature.tsp?genericPartNumber=ADS1298R&fileType=pdf; PartNumber: ADS1298RIZXGT; ComponentLink3URL: http://www.ti.com/litv/pdf/mpbg581; DatasheetVersion: SBAS459I; PackageDescription: 64-Pin Plastic Ball Grid Array, Body 8 x 8 mm, Pitch 0.8 mm; ComponentLink1Description: Manufacturer URL; PackageReference: ZXG64; Mounting Technology: Surface Mount; ComponentLink2Description: Datasheet; ComponentLink3Description: Package Specification
U3 = CMP-13559-000004-1: IC VREF SERIES 0.3% SOT23-3; Operating Supply Current: 1.5uA; Temperature Coefficient: 50ppm/°C; Output Type: Fixed; Output Current: 7mA; Min Output Voltage: 2.048V; Tolerance: 0.3%; Packaging: Tape and Reel; RoHS Compliant: Yes; Reference Type: Series; Min Operating Temperature: -40°C; Max Operating Temperature: 85°C; Mount: Surface Mount; Case/Package: TO-236-3
Y1 = CMP-25159-259502-1: MEMS OSC 2.048MHZ LVCMOS; Frequency Stability: 50ppm; Packaging: Cut Tape; Series: SiT8021; Length: 0.061inch; Height: 0.024inch; RoHS Compliant: Yes; Min Operating Temperature: -40°C; Width: 0.033inch; Frequency: 2.048MHz; Max Operating Temperature: 85°C; Mount: Surface Mount

## Sheet 04_gap_interface.SchDoc: BioGAP ExG shield
size A2; Author: Sebastian Frey; DrawnBy: Sebastian Frey; Engineer: Sebastian Frey; Organization: Integrated System Laboratory; DocumentNumber: 4; Revision: v1.0; SheetNumber: 4; SheetTotal: 4
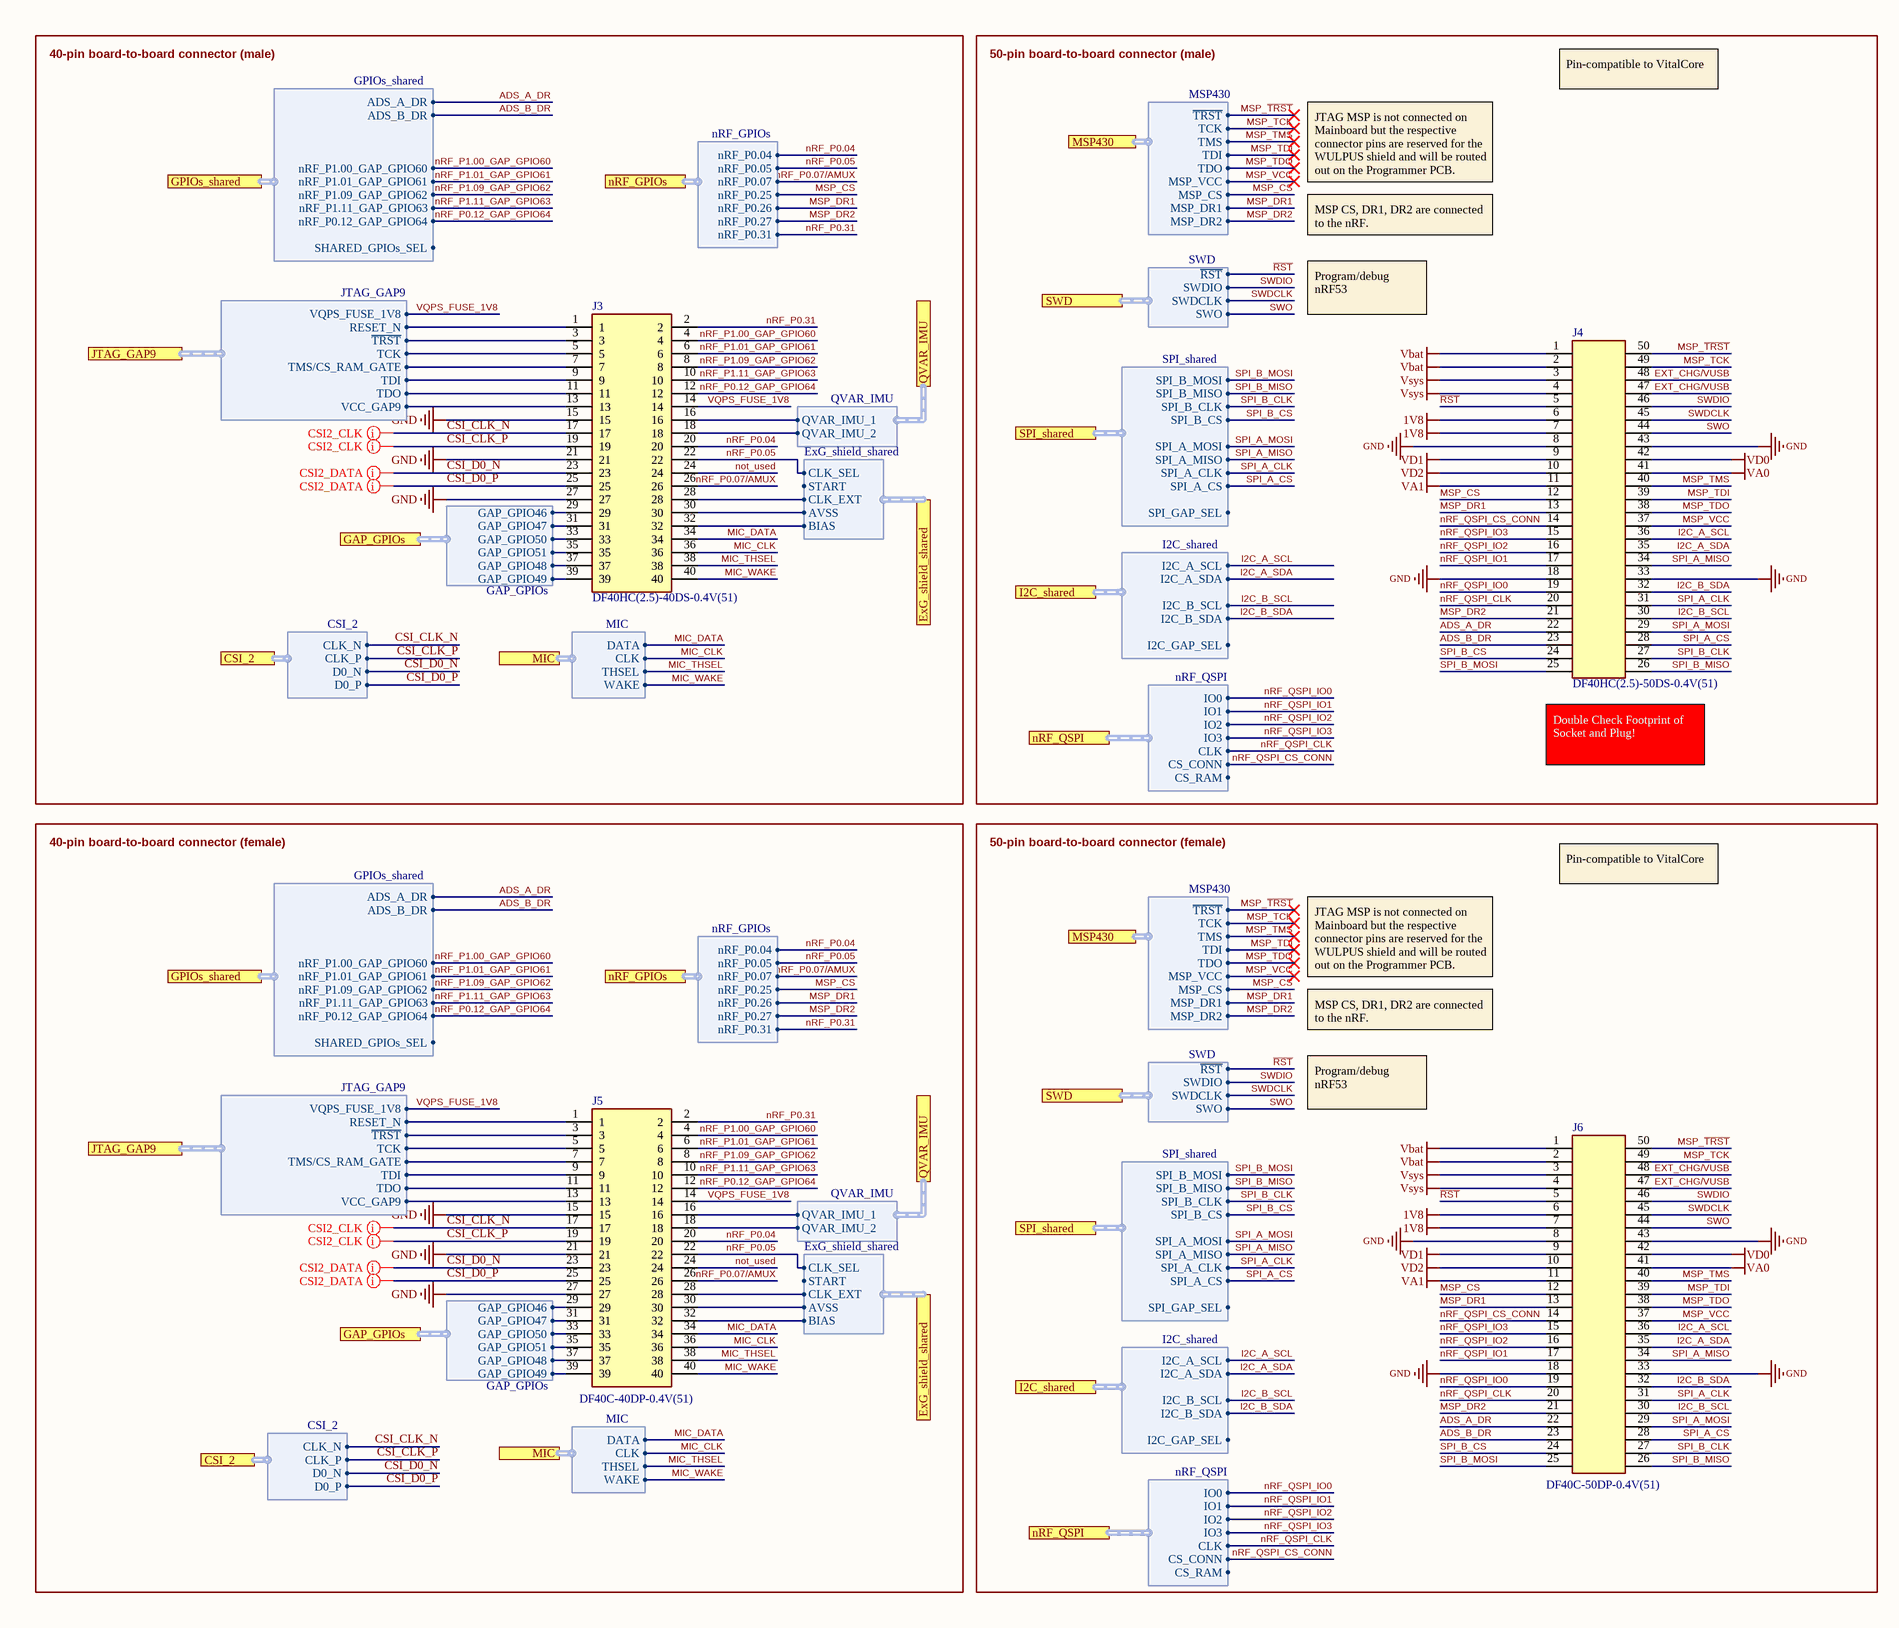
[diagram p2: 04_gap_interface.SchDoc, left]
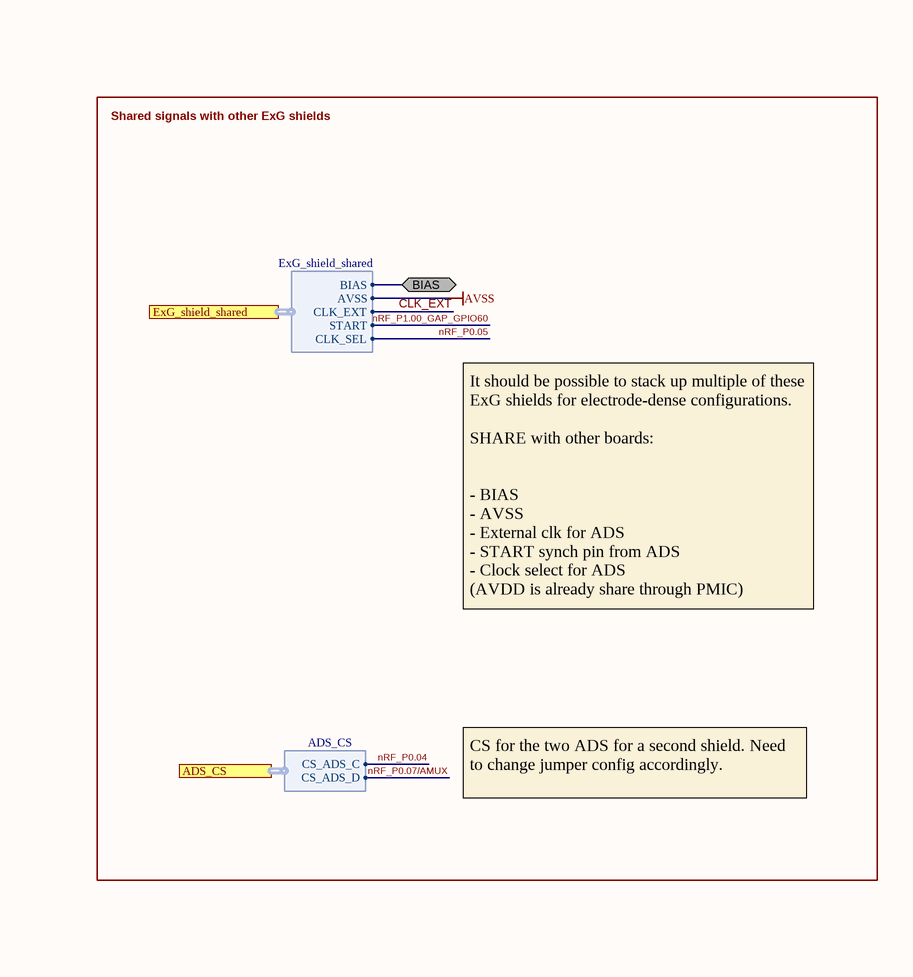
[diagram p3: 04_gap_interface.SchDoc, right]

### Parts
J3  DF40HC(2.5)-40DS-0.4V(51)  [DF40HC3040DS04V51]
J4  DF40HC(2.5)-50DS-0.4V(51)  [DF40HC3050DS04V51]
J5  DF40C-40DP-0.4V(51)  [FP-DF40C-40DP-0_4V_51-MFG]
J6  DF40C-50DP-0.4V(51)  [CONN_COMBI_50P]

### Blocks framed on the sheet
40-pin board-to-board connector (male): J3
50-pin board-to-board connector (male): J4
40-pin board-to-board connector (female): J5
50-pin board-to-board connector (female): J6

### Ports
ADS_CS (harness ADS_CS), BIAS (bidir), CSI_2 (harness CSI_2), ExG_shield_shared (harness ExG_shield_shared), GAP_GPIOs (harness GAP_GPIOs), GPIOs_shared (harness GPIOs_shared), I2C_shared (harness I2C_shared), JTAG_GAP9 (harness JTAG_GAP9), MIC (harness MIC), MSP430 (harness MSP430), nRF_GPIOs (harness nRF_GPIOs), nRF_QSPI (harness nRF_QSPI), QVAR_IMU (harness QVAR_IMU), SPI_shared (harness SPI_shared), SWD (harness SWD)

### Harnesses
QVAR_IMU: QVAR_IMU_2, QVAR_IMU_1
MIC: DATA, THSEL, WAKE, CLK
GAP_GPIOs: GAP_GPIO46, GAP_GPIO47, GAP_GPIO50, GAP_GPIO51, GAP_GPIO48, GAP_GPIO49
GPIOs_shared: ADS_A_DR, ADS_B_DR, nRF_P1.00_GAP_GPIO60, nRF_P1.09_GAP_GPIO62, nRF_P1.11_GAP_GPIO63, nRF_P0.12_GAP_GPIO64, SHARED_GPIOs_SEL, nRF_P1.01_GAP_GPIO61
nRF_GPIOs: nRF_P0.07, nRF_P0.25, nRF_P0.05, nRF_P0.04, nRF_P0.26, nRF_P0.27, nRF_P0.31
CSI_2: CLK_N, CLK_P, D0_P, D0_N
JTAG_GAP9: ~{TRST}, TCK, TMS/CS_RAM_GATE, TDI, TDO, VCC_GAP9, RESET_N, VQPS_FUSE_1V8
SWD: ~{RST}, SWDIO, SWDCLK, SWO
nRF_QSPI: IO0, IO1, IO2, IO3, CLK, CS_CONN, CS_RAM
SPI_shared: SPI_B_MOSI, SPI_B_MISO, SPI_B_CLK, SPI_B_CS, SPI_A_MOSI, SPI_A_MISO, SPI_A_CLK, SPI_A_CS, SPI_GAP_SEL
I2C_shared: I2C_A_SCL, I2C_A_SDA, I2C_B_SCL, I2C_B_SDA, I2C_GAP_SEL
MSP430: ~{TRST}, TCK, TMS, TDI, TDO, MSP_VCC, MSP_DR1, MSP_DR2, MSP_CS
ExG_shield_shared: BIAS, AVSS, CLK_EXT, START, CLK_SEL
ADS_CS: CS_ADS_C, CS_ADS_D

### Nets
1V8: J4.6 J4.7 J6.6 J6.7
AVSS: J3.30 J5.30 ; port ExG_shield_shared.AVSS
GND: J3.15 J3.21 J3.27 J4.8 J4.18 J4.33 J4.43 J5.15 J5.21 J5.27 J6.8 J6.18 J6.33 J6.43
VA0: J4.41 J6.41
VA1: J4.11 J6.11
Vbat: J4.1 J4.2 J6.1 J6.2
VD0: J4.42 J6.42
VD1: J4.9 J6.9
VD2: J4.10 J6.10
Vsys: J4.3 J4.4 J6.3 J6.4
ADS_A_DR: J4.22 J6.22 ; port GPIOs_shared.ADS_A_DR
ADS_B_DR: J4.23 J6.23 ; port GPIOs_shared.ADS_B_DR
BIAS: J3.32 J5.32 ; port BIAS, port ExG_shield_shared.BIAS
CLK_EXT: J3.28 J5.28 ; port ExG_shield_shared.CLK_EXT
CSI_CLK_N: J3.17 J5.17 ; port CSI_2.CLK_N
CSI_CLK_P: J3.19 J5.19 ; port CSI_2.CLK_P
CSI_D0_N: J3.23 J5.23 ; port CSI_2.D0_N
CSI_D0_P: J3.25 J5.25 ; port CSI_2.D0_P
EXT_CHG/VUSB: J4.47 J4.48 J6.47 J6.48
I2C_A_SCL: J4.36 J6.36 ; port I2C_shared.I2C_A_SCL
I2C_A_SDA: J4.35 J6.35 ; port I2C_shared.I2C_A_SDA
I2C_B_SCL: J4.30 J6.30 ; port I2C_shared.I2C_B_SCL
I2C_B_SDA: J4.32 J6.32 ; port I2C_shared.I2C_B_SDA
MIC_CLK: J3.36 J5.36 ; port MIC.CLK
MIC_DATA: J3.34 J5.34 ; port MIC.DATA
MIC_THSEL: J3.38 J5.38 ; port MIC.THSEL
MIC_WAKE: J3.40 J5.40 ; port MIC.WAKE
MSP_CS: J4.12 J6.12 ; port nRF_GPIOs.nRF_P0.25, port MSP430.MSP_CS
MSP_DR1: J4.13 J6.13 ; port nRF_GPIOs.nRF_P0.26, port MSP430.MSP_DR1
MSP_DR2: J4.21 J6.21 ; port nRF_GPIOs.nRF_P0.27, port MSP430.MSP_DR2
MSP_~{TRST}: J4.50 J6.50 ; port MSP430.~{TRST}
MSP_TCK: J4.49 J6.49 ; port MSP430.TCK
MSP_TDI: J4.39 J6.39 ; port MSP430.TDI
MSP_TDO: J4.38 J6.38 ; port MSP430.TDO
MSP_TMS: J4.40 J6.40 ; port MSP430.TMS
MSP_VCC: J4.37 J6.37 ; port MSP430.MSP_VCC
not_used: J3.24 J5.24
nRF_P0.04: J3.20 J5.20 ; port nRF_GPIOs.nRF_P0.04, port ADS_CS.CS_ADS_C
nRF_P0.05: J3.22 J5.22 ; port nRF_GPIOs.nRF_P0.05, port ExG_shield_shared.CLK_SEL
nRF_P0.07/AMUX: J3.26 J5.26 ; port nRF_GPIOs.nRF_P0.07, port ADS_CS.CS_ADS_D
nRF_P0.12_GAP_GPIO64: J3.12 J5.12 ; port GPIOs_shared.nRF_P0.12_GAP_GPIO64
nRF_P0.31: J3.2 J5.2 ; port nRF_GPIOs.nRF_P0.31
nRF_P1.00_GAP_GPIO60: J3.4 J5.4 ; port GPIOs_shared.nRF_P1.00_GAP_GPIO60, port ExG_shield_shared.START
nRF_P1.01_GAP_GPIO61: J3.6 J5.6 ; port GPIOs_shared.nRF_P1.01_GAP_GPIO61
nRF_P1.09_GAP_GPIO62: J3.8 J5.8 ; port GPIOs_shared.nRF_P1.09_GAP_GPIO62
nRF_P1.11_GAP_GPIO63: J3.10 J5.10 ; port GPIOs_shared.nRF_P1.11_GAP_GPIO63
nRF_QSPI_CLK: J4.20 J6.20 ; port nRF_QSPI.CLK
nRF_QSPI_CS_CONN: J4.14 J6.14 ; port nRF_QSPI.CS_CONN
nRF_QSPI_IO0: J4.19 J6.19 ; port nRF_QSPI.IO0
nRF_QSPI_IO1: J4.17 J6.17 ; port nRF_QSPI.IO1
nRF_QSPI_IO2: J4.16 J6.16 ; port nRF_QSPI.IO2
nRF_QSPI_IO3: J4.15 J6.15 ; port nRF_QSPI.IO3
~{RST}: J4.5 J6.5 ; port SWD.~{RST}
SPI_A_CLK: J4.31 J6.31 ; port SPI_shared.SPI_A_CLK
SPI_A_CS: J4.28 J6.28 ; port SPI_shared.SPI_A_CS
SPI_A_MISO: J4.34 J6.34 ; port SPI_shared.SPI_A_MISO
SPI_A_MOSI: J4.29 J6.29 ; port SPI_shared.SPI_A_MOSI
SPI_B_CLK: J4.27 J6.27 ; port SPI_shared.SPI_B_CLK
SPI_B_CS: J4.24 J6.24 ; port SPI_shared.SPI_B_CS
SPI_B_MISO: J4.26 J6.26 ; port SPI_shared.SPI_B_MISO
SPI_B_MOSI: J4.25 J6.25 ; port SPI_shared.SPI_B_MOSI
SWDCLK: J4.45 J6.45 ; port SWD.SWDCLK
SWDIO: J4.46 J6.46 ; port SWD.SWDIO
SWO: J4.44 J6.44 ; port SWD.SWO
VQPS_FUSE_1V8: J3.14 J5.14 ; port JTAG_GAP9.VQPS_FUSE_1V8
NetJ3_1: J3.1 J5.1 ; port JTAG_GAP9.RESET_N
NetJ3_3: J3.3 J5.3 ; port JTAG_GAP9.~{TRST}
NetJ3_5: J3.5 J5.5 ; port JTAG_GAP9.TCK
NetJ3_7: J3.7 J5.7 ; port JTAG_GAP9.TMS/CS_RAM_GATE
NetJ3_9: J3.9 J5.9 ; port JTAG_GAP9.TDI
NetJ3_11: J3.11 J5.11 ; port JTAG_GAP9.TDO
NetJ3_13: J3.13 J5.13 ; port JTAG_GAP9.VCC_GAP9
NetJ3_16: J3.16 J5.16 ; port QVAR_IMU.QVAR_IMU_1
NetJ3_18: J3.18 J5.18 ; port QVAR_IMU.QVAR_IMU_2
NetJ3_29: J3.29 J5.29 ; port GAP_GPIOs.GAP_GPIO46
NetJ3_31: J3.31 J5.31 ; port GAP_GPIOs.GAP_GPIO47
NetJ3_33: J3.33 J5.33 ; port GAP_GPIOs.GAP_GPIO50
NetJ3_35: J3.35 J5.35 ; port GAP_GPIOs.GAP_GPIO51
NetJ3_37: J3.37 J5.37 ; port GAP_GPIOs.GAP_GPIO48
NetJ3_39: J3.39 J5.39 ; port GAP_GPIOs.GAP_GPIO49

### Layout directives
net class CSI2_CLK: CSI_CLK_N, CSI_CLK_P
net class CSI2_DATA: CSI_D0_N, CSI_D0_P

### Notes on the sheet
- Pin-compatible to VitalCore
- JTAG MSP is not connected on Mainboard but the respective connector pins are reserved for the WULPUS shield and will be routed out on the Programmer PCB.
- MSP CS, DR1, DR2 are connected to the nRF.
- Program/debug nRF53
- Shared signals with other ExG shields
- (near J4) Double Check Footprint of Socket and Plug!
- It should be possible to stack up multiple of these ExG shields for electrode-dense configurations.
  SHARE with other boards:
  - BIAS
  - AVSS
  - External clk for ADS
  - START synch pin from ADS
  - Clock select for ADS
  (AVDD is already share through PMIC)
- CS for the two ADS for a second shield. Need to change jumper config accordingly.
- Drawing title:
- Drawing number:
- Rev:
- Format:
- Laboratory:
- Project:
- File:
- Date:
- A2
- Drawn by:
- Page
- of

### Library data of the parts
J3 = DF40HC(3.0)-40DS-0.4V(51): 40 Position 0.4mm Pitch Dual Row Vertical Surface Mount (SMT) Pin Socket, 2.5mm Stacking Height; System: Connector; Package: None; Availability: Unavailable; Value: *; MP: DF40HC(3.0)-40DS-0.4V(51); Price: None
J4 = DF40HC(3.0)-50DS-0.4V(51): 50 Position 0.4mm Pitch Dual Row Vertical Surface Mount (SMT) Pin Socket, 2.5mm Stacking Height; Mfr_Name: Hirose; Copyright: Copyright (C) 2023 Ultra Librarian. All rights reserved.; Manufacturer_Part_Number: DF40HC(3.0)-50DS-0.4V(51); RefDes: RefDes; Type: DEV
J5 = DF40C-40DP-0.4V(51): 50 Position 0.4mm Pitch Dual Row Vertical Surface Mount (SMT) Receptacle; Connector Type: Plug; Number of Contacts: 40; Gender: Male; Voltage Rating: 30V; Mated Stacking Heights: 4mm; Current Rating: 300mA; System: Connector; Lead Free: Lead Free; Number of Positions: 40; Packaging: Tape and Reel; Contact Plating: Gold; REACH SVHC: No SVHC; Mount: Surface Mount; Orientation: Straight; Housing Material: Polymer; Termination: SMD/SMT; Min Operating Temperature: -35°C; Number of Rows: 2; Max Operating Temperature: 85°C; Pitch: 0.4mm; Contact Material: Bronze; Package Quantity: 1
J6 = DF40C-50DP-0.4V(51): 50 Position 0.4mm Pitch Dual Row Vertical Surface Mount (SMT) Receptacle,; Mfr_Name: Hirose; System: Connector; Copyright: Copyright (C) 2023 Ultra Librarian. All rights reserved.; Manufacturer_Part_Number: DF40C-50DP-0.4V(51); RefDes: RefDes; Type: DEV

## Sheet 03_electrode_interface_new.SchDoc: BioGAP EMG shield
size A3
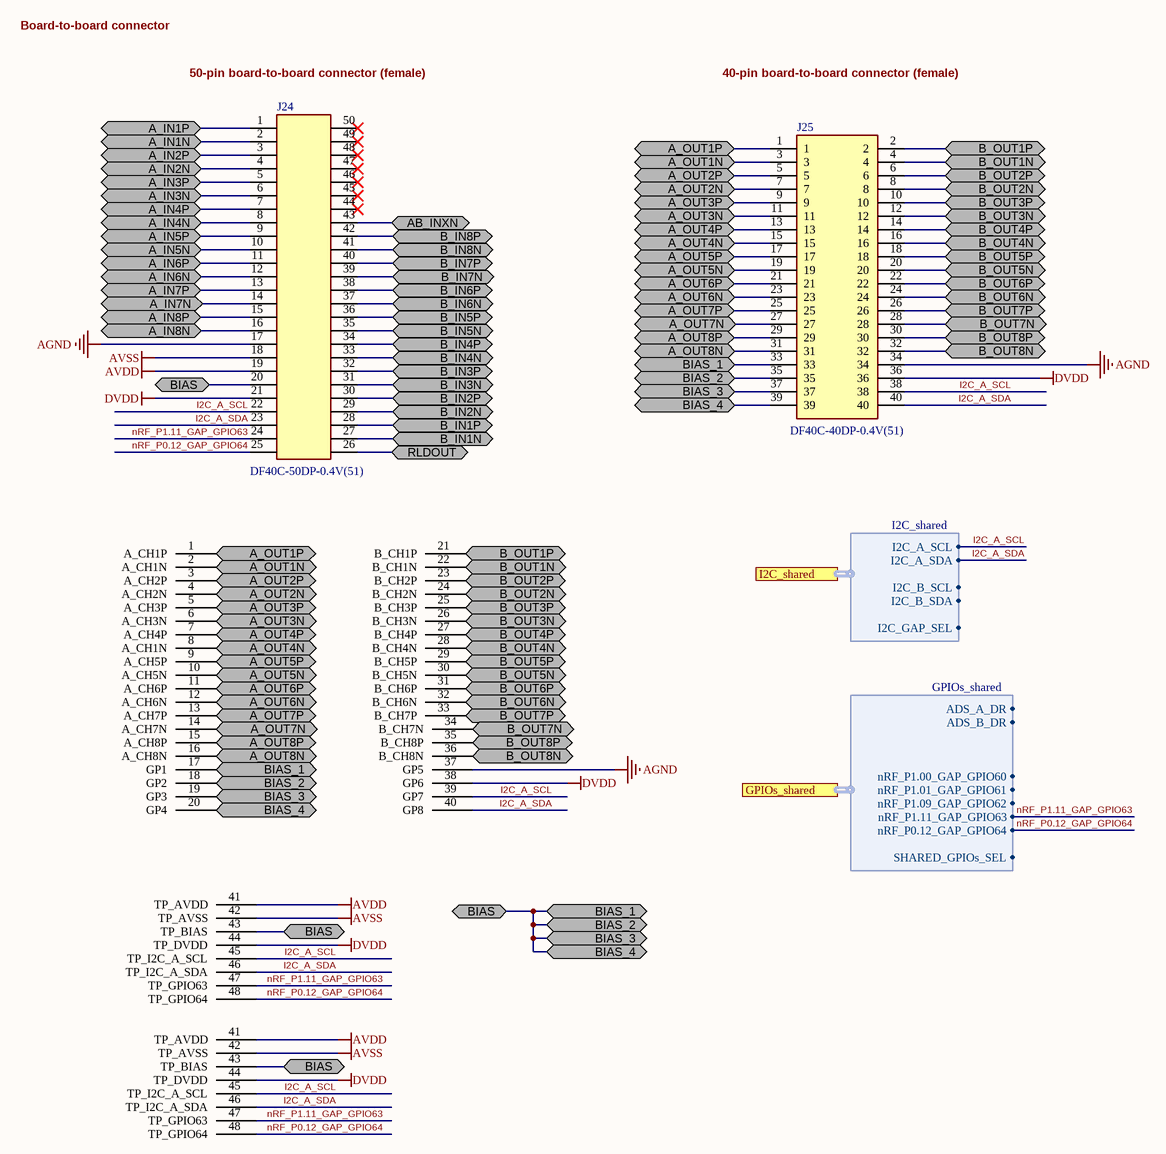
[diagram p4: 03_electrode_interface_new.SchDoc]

### Parts
AGND  0603_pad1_37  [0603_PAD_2 - duplicate37]  (value not drawn)
BIAS_1  0603_pad1_17  [0603_PAD_2 - duplicate17]  (value not drawn)
BIAS_2  0603_pad1_18  [0603_PAD_2 - duplicate18]  (value not drawn)
BIAS_3  0603_pad1_19  [0603_PAD_2 - duplicate19]  (value not drawn)
BIAS_4  0603_pad1_20  [0603_PAD_2 - duplicate20]  (value not drawn)
DVDD  0603_pad1_38  [0603_PAD_2 - duplicate38]  (value not drawn)
I2C_A_SCL  0603_pad1_39  [0603_PAD_2 - duplicate39]  (value not drawn)
I2C_A_SDA  0603_pad1_40  [0603_PAD_2 - duplicate40]  (value not drawn)
J24  DF40C-50DP-0.4V(51)  [CONN_COMBI_50P]
J25  DF40C-40DP-0.4V(51)  [FP-DF40C-40DP-0_4V_51-MFG]
J_A1N  0603_pad1_2  [0603_PAD_2 - duplicate2]  (value not drawn)
J_A1P  0603_pad1_1  [0603_PAD_2 - duplicate1]  (value not drawn)
J_A2N  0603_pad1_4  [0603_PAD_2 - duplicate4]  (value not drawn)
J_A2P  0603_pad1_3  [0603_PAD_2 - duplicate3]  (value not drawn)
J_A3N  0603_pad1_6  [0603_PAD_2 - duplicate6]  (value not drawn)
J_A3P  0603_pad1_5  [0603_PAD_2 - duplicate5]  (value not drawn)
J_A4N  0603_pad1_8  [0603_PAD_2 - duplicate8]  (value not drawn)
J_A4P  0603_pad1_7  [0603_PAD_2 - duplicate7]  (value not drawn)
J_A5N  0603_pad1_10  [0603_PAD_2 - duplicate10]  (value not drawn)
J_A5P  0603_pad1_9  [0603_PAD_2 - duplicate9]  (value not drawn)
J_A6N  0603_pad1_12  [0603_PAD_2 - duplicate12]  (value not drawn)
J_A6P  0603_pad1_11  [0603_PAD_2 - duplicate11]  (value not drawn)
J_A7N  0603_pad1_14  [0603_PAD_2 - duplicate14]  (value not drawn)
J_A7P  0603_pad1_13  [0603_PAD_2 - duplicate13]  (value not drawn)
J_A8N  0603_pad1_16  [0603_PAD_2 - duplicate16]  (value not drawn)
J_A8P  0603_pad1_15  [0603_PAD_2 - duplicate15]  (value not drawn)
J_B1N  0603_pad1_22  [0603_PAD_2 - duplicate22]  (value not drawn)
J_B1P  0603_pad1_21  [0603_PAD_2 - duplicate21]  (value not drawn)
J_B2N  0603_pad1_24  [0603_PAD_2 - duplicate24]  (value not drawn)
J_B2P  0603_pad1_23  [0603_PAD_2 - duplicate23]  (value not drawn)
J_B3N  0603_pad1_26  [0603_PAD_2 - duplicate26]  (value not drawn)
J_B3P  0603_pad1_25  [0603_PAD_2 - duplicate25]  (value not drawn)
J_B4N  0603_pad1_28  [0603_PAD_2 - duplicate28]  (value not drawn)
J_B4P  0603_pad1_27  [0603_PAD_2 - duplicate27]  (value not drawn)
J_B5N  0603_pad1_30  [0603_PAD_2 - duplicate30]  (value not drawn)
J_B5P  0603_pad1_29  [0603_PAD_2 - duplicate29]  (value not drawn)
J_B6N  0603_pad1_32  [0603_PAD_2 - duplicate32]  (value not drawn)
J_B6P  0603_pad1_31  [0603_PAD_2 - duplicate31]  (value not drawn)
J_B7N  0603_pad1_34  [0603_PAD_2 - duplicate34]  (value not drawn)
J_B7P  0603_pad1_33  [0603_PAD_2 - duplicate33]  (value not drawn)
J_B8N  0603_pad1_36  [0603_PAD_2 - duplicate36]  (value not drawn)
J_B8P  0603_pad1_35  [0603_PAD_2 - duplicate35]  (value not drawn)
TP_AVDD  TP_AVDD  [TP_AVDD]  (value not drawn)
TP_AVDD_1  TP_AVDD  [TP_AVDD]  (value not drawn)
TP_AVSS  TP_AVSS  [TP_AVSS]  (value not drawn)
TP_AVSS_1  TP_AVSS  [TP_AVSS]  (value not drawn)
TP_BIAS  TP_BIAS  [TP_BIAS]  (value not drawn)
TP_BIAS_1  TP_BIAS  [TP_BIAS]  (value not drawn)
TP_DVDD  TP_DVDD  [TP_DVDD]  (value not drawn)
TP_DVDD_1  TP_DVDD  [TP_DVDD]  (value not drawn)
TP_GPIO63  TP_GPIO63  [TP_GPIO63]  (value not drawn)
TP_GPIO63_1  TP_GPIO63  [TP_GPIO63]  (value not drawn)
TP_GPIO64  TP_GPIO64  [TP_GPIO64]  (value not drawn)
TP_GPIO64_1  TP_GPIO64  [TP_GPIO64]  (value not drawn)
TP_I2C_A_SCL  TP_I2C_A_SCL  [TP_I2C_A_SCL]  (value not drawn)
TP_I2C_A_SCL_1  TP_I2C_A_SCL  [TP_I2C_A_SCL]  (value not drawn)
TP_I2C_A_SDA  TP_I2C_A_SDA  [TP_I2C_A_SDA]  (value not drawn)
TP_I2C_A_SDA_1  TP_I2C_A_SDA  [TP_I2C_A_SDA]  (value not drawn)

### Ports
A_IN1N (bidir), A_IN1P (bidir), A_IN2N (bidir), A_IN2P (bidir), A_IN3N (bidir), A_IN3P (bidir), A_IN4N (bidir), A_IN4P (bidir), A_IN5N (bidir), A_IN5P (bidir), A_IN6N (bidir), A_IN6P (bidir), A_IN7N (bidir), A_IN7P (bidir), A_IN8N (bidir), A_IN8P (bidir), A_OUT1N (bidir), A_OUT1P (bidir), A_OUT2N (bidir), A_OUT2P (bidir), A_OUT3N (bidir), A_OUT3P (bidir), A_OUT4N (bidir), A_OUT4P (bidir), A_OUT5N (bidir), A_OUT5P (bidir), A_OUT6N (bidir), A_OUT6P (bidir), A_OUT7N (bidir), A_OUT7P (bidir), A_OUT8N (bidir), A_OUT8P (bidir), AB_INXN (bidir), B_IN1N (bidir), B_IN1P (bidir), B_IN2N (bidir), B_IN2P (bidir), B_IN3N (bidir), B_IN3P (bidir), B_IN4N (bidir), B_IN4P (bidir), B_IN5N (bidir), B_IN5P (bidir), B_IN6N (bidir), B_IN6P (bidir), B_IN7N (bidir), B_IN7P (bidir), B_IN8N (bidir), B_IN8P (bidir), B_OUT1N (bidir), B_OUT1P (bidir), B_OUT2N (bidir), B_OUT2P (bidir), B_OUT3N (bidir), B_OUT3P (bidir), B_OUT4N (bidir), B_OUT4P (bidir), B_OUT5N (bidir), B_OUT5P (bidir), B_OUT6N (bidir), B_OUT6P (bidir), B_OUT7N (bidir), B_OUT7P (bidir), B_OUT8N (bidir), B_OUT8P (bidir), BIAS (bidir), BIAS_1 (bidir), BIAS_2 (bidir), BIAS_3 (bidir), BIAS_4 (bidir), GPIOs_shared (harness GPIOs_shared), I2C_shared (harness I2C_shared), RLDOUT (bidir)

### Harnesses
GPIOs_shared: ADS_A_DR, ADS_B_DR, nRF_P1.00_GAP_GPIO60, nRF_P1.09_GAP_GPIO62, nRF_P1.11_GAP_GPIO63, nRF_P0.12_GAP_GPIO64, SHARED_GPIOs_SEL, nRF_P1.01_GAP_GPIO61
I2C_shared: I2C_A_SCL, I2C_A_SDA, I2C_B_SCL, I2C_B_SDA, I2C_GAP_SEL

### Nets
AGND: AGND.37(GP5) J24.17 J25.34
AVDD: J24.19 TP_AVDD.41(TP_AVDD) TP_AVDD_1.41(TP_AVDD)
AVSS: J24.18 TP_AVSS.42(TP_AVSS) TP_AVSS_1.42(TP_AVSS)
DVDD: DVDD.38(GP6) J24.21 J25.36 TP_DVDD.44(TP_DVDD) TP_DVDD_1.44(TP_DVDD)
A_IN1N: J24.2 ; port A_IN1N
A_IN1P: J24.1 ; port A_IN1P
A_IN2N: J24.4 ; port A_IN2N
A_IN2P: J24.3 ; port A_IN2P
A_IN3N: J24.6 ; port A_IN3N
A_IN3P: J24.5 ; port A_IN3P
A_IN4N: J24.8 ; port A_IN4N
A_IN4P: J24.7 ; port A_IN4P
A_IN5N: J24.10 ; port A_IN5N
A_IN5P: J24.9 ; port A_IN5P
A_IN6N: J24.12 ; port A_IN6N
A_IN6P: J24.11 ; port A_IN6P
A_IN7N: J24.14 ; port A_IN7N
A_IN7P: J24.13 ; port A_IN7P
A_IN8N: J24.16 ; port A_IN8N
A_IN8P: J24.15 ; port A_IN8P
B_IN1N: J24.27 ; port B_IN1N
B_IN1P: J24.28 ; port B_IN1P
B_IN2N: J24.29 ; port B_IN2N
B_IN2P: J24.30 ; port B_IN2P
B_IN3N: J24.31 ; port B_IN3N
B_IN3P: J24.32 ; port B_IN3P
B_IN4N: J24.33 ; port B_IN4N
B_IN4P: J24.34 ; port B_IN4P
B_IN5N: J24.35 ; port B_IN5N
B_IN5P: J24.36 ; port B_IN5P
B_IN6N: J24.37 ; port B_IN6N
B_IN6P: J24.38 ; port B_IN6P
B_IN7N: J24.39 ; port B_IN7N
B_IN7P: J24.40 ; port B_IN7P
B_IN8N: J24.41 ; port B_IN8N
B_IN8P: J24.42 ; port B_IN8P
BIAS: BIAS_1.17(GP1) BIAS_2.18(GP2) BIAS_3.19(GP3) BIAS_4.20(GP4) J24.20 J25.33 J25.35 J25.37 J25.39 TP_BIAS.43(TP_BIAS) TP_BIAS_1.43(TP_BIAS) ; port BIAS, port BIAS_2, port BIAS_3, port BIAS_4, port BIAS_1
I2C_A_SCL: I2C_A_SCL.39(GP7) J24.22 J25.38 TP_I2C_A_SCL.45(TP_I2C_A_SCL) TP_I2C_A_SCL_1.45(TP_I2C_A_SCL) ; port I2C_shared.I2C_A_SCL
I2C_A_SDA: I2C_A_SDA.40(GP8) J24.23 J25.40 TP_I2C_A_SDA.46(TP_I2C_A_SDA) TP_I2C_A_SDA_1.46(TP_I2C_A_SDA) ; port I2C_shared.I2C_A_SDA
nRF_P0.12_GAP_GPIO64: J24.25 TP_GPIO64.48(TP_GPIO64) TP_GPIO64_1.48(TP_GPIO64) ; port GPIOs_shared.nRF_P0.12_GAP_GPIO64
nRF_P1.11_GAP_GPIO63: J24.24 TP_GPIO63.47(TP_GPIO63) TP_GPIO63_1.47(TP_GPIO63) ; port GPIOs_shared.nRF_P1.11_GAP_GPIO63
RLDOUT: J24.26 ; port RLDOUT
NetJ24_43: J24.43 ; port AB_INXN
NetJ25_1: J25.1 J_A1P.1(A_CH1P) ; port A_OUT1P
NetJ25_2: J25.2 J_B1P.21(B_CH1P) ; port B_OUT1P
NetJ25_3: J25.3 J_A1N.2(A_CH1N) ; port A_OUT1N
NetJ25_4: J25.4 J_B1N.22(B_CH1N) ; port B_OUT1N
NetJ25_5: J25.5 J_A2P.3(A_CH2P) ; port A_OUT2P
NetJ25_6: J25.6 J_B2P.23(B_CH2P) ; port B_OUT2P
NetJ25_7: J25.7 J_A2N.4(A_CH2N) ; port A_OUT2N
NetJ25_8: J25.8 J_B2N.24(B_CH2N) ; port B_OUT2N
NetJ25_9: J25.9 J_A3P.5(A_CH3P) ; port A_OUT3P
NetJ25_10: J25.10 J_B3P.25(B_CH3P) ; port B_OUT3P
NetJ25_11: J25.11 J_A3N.6(A_CH3N) ; port A_OUT3N
NetJ25_12: J25.12 J_B3N.26(B_CH3N) ; port B_OUT3N
NetJ25_13: J25.13 J_A4P.7(A_CH4P) ; port A_OUT4P
NetJ25_14: J25.14 J_B4P.27(B_CH4P) ; port B_OUT4P
NetJ25_15: J25.15 J_A4N.8(A_CH1N) ; port A_OUT4N
NetJ25_16: J25.16 J_B4N.28(B_CH4N) ; port B_OUT4N
NetJ25_17: J25.17 J_A5P.9(A_CH5P) ; port A_OUT5P
NetJ25_18: J25.18 J_B5P.29(B_CH5P) ; port B_OUT5P
NetJ25_19: J25.19 J_A5N.10(A_CH5N) ; port A_OUT5N
NetJ25_20: J25.20 J_B5N.30(B_CH5N) ; port B_OUT5N
NetJ25_21: J25.21 J_A6P.11(A_CH6P) ; port A_OUT6P
NetJ25_22: J25.22 J_B6P.31(B_CH6P) ; port B_OUT6P
NetJ25_23: J25.23 J_A6N.12(A_CH6N) ; port A_OUT6N
NetJ25_24: J25.24 J_B6N.32(B_CH6N) ; port B_OUT6N
NetJ25_25: J25.25 J_A7P.13(A_CH7P) ; port A_OUT7P
NetJ25_26: J25.26 J_B7P.33(B_CH7P) ; port B_OUT7P
NetJ25_27: J25.27 J_A7N.14(A_CH7N) ; port A_OUT7N
NetJ25_28: J25.28 J_B7N.34(B_CH7N) ; port B_OUT7N
NetJ25_29: J25.29 J_A8P.15(A_CH8P) ; port A_OUT8P
NetJ25_30: J25.30 J_B8P.35(B_CH8P) ; port B_OUT8P
NetJ25_31: J25.31 J_A8N.16(A_CH8N) ; port A_OUT8N
NetJ25_32: J25.32 J_B8N.36(B_CH8N) ; port B_OUT8N

Not connected (* = marked no-connect by the designer): J24 44* 45* 46* 47* 48* 49* 50*

### Notes on the sheet
- Board-to-board connector
- (near J24) 50-pin board-to-board connector (female)
- 40-pin board-to-board connector (female)
- 1
- 2
- 3
- 4
- 5
- 6
- 7
- 8
- A
- B
- C
- D
- Project:
- Date:
- Drawing number:
- Rev:
- Format:
- A3
- Drawn by:
- Laboratory:
- Page
- Sheet:
- of
- File:

### Library data of the parts
J24 = DF40C-50DP-0.4V(51): as J6 on sheet 04_gap_interface; Copyright: Copyright (C) 2023 Ultra Librarian. All rights reserved.; Manufacturer_Part_Number: DF40C-50DP-0.4V(51); RefDes: RefDes; Type: DEV
J25 = DF40C-40DP-0.4V(51): as J5 on sheet 04_gap_interface; Lead Free: Lead Free; Number of Positions: 40; Packaging: Tape and Reel; Contact Plating: Gold; REACH SVHC: No SVHC; Mount: Surface Mount; Orientation: Straight; Housing Material: Polymer; Termination: SMD/SMT; Min Operating Temperature: -35°C; Number of Rows: 2; Max Operating Temperature: 85°C; Pitch: 0.4mm; Contact Material: Bronze; Package Quantity: 1

## Nets that join several sheets
1V8: 01_power (C39.1 U6.A2), 04_gap_interface (J4.6 J4.7 J6.6 J6.7)
AGND: 01_power (C41.1 C42.1), 02_AFE (10 pins), 03_electrode_interface_new (AGND.37 J24.17 J25.34)
AVDD: 01_power (R14.1), 02_AFE (19 pins), 03_electrode_interface_new (J24.19 TP_AVDD.41 TP_AVDD_1.41)
AVSS: 01_power (C41.2 C42.2 R13.1), 02_AFE (41 pins), 04_gap_interface (J3.30 J5.30), 03_electrode_interface_new (J24.18 TP_AVSS.42 TP_AVSS_1.42)
DVDD: 01_power (C40.1 U6.A1), 02_AFE (14 pins), 03_electrode_interface_new (5 pins)
GND: 01_power (9 pins), 02_AFE (20 pins), 04_gap_interface (14 pins)
VA1: 01_power (R14.2), 04_gap_interface (J4.11 J6.11)
VD1: 01_power (C36.1 U4.1 U4.6), 04_gap_interface (J4.9 J6.9)
A_IN1N: 02_AFE (U1.H2), 03_electrode_interface_new (J24.2)
A_IN1P: 02_AFE (U1.H1), 03_electrode_interface_new (J24.1)
A_IN2N: 02_AFE (U1.G2), 03_electrode_interface_new (J24.4)
A_IN2P: 02_AFE (U1.G1), 03_electrode_interface_new (J24.3)
A_IN3N: 02_AFE (U1.F2), 03_electrode_interface_new (J24.6)
A_IN3P: 02_AFE (U1.F1), 03_electrode_interface_new (J24.5)
A_IN4N: 02_AFE (U1.E2), 03_electrode_interface_new (J24.8)
A_IN4P: 02_AFE (U1.E1), 03_electrode_interface_new (J24.7)
A_IN5N: 02_AFE (U1.D2), 03_electrode_interface_new (J24.10)
A_IN5P: 02_AFE (U1.D1), 03_electrode_interface_new (J24.9)
A_IN6N: 02_AFE (U1.C2), 03_electrode_interface_new (J24.12)
A_IN6P: 02_AFE (U1.C1), 03_electrode_interface_new (J24.11)
A_IN7N: 02_AFE (U1.B2), 03_electrode_interface_new (J24.14)
A_IN7P: 02_AFE (U1.B1), 03_electrode_interface_new (J24.13)
A_IN8N: 02_AFE (U1.A2), 03_electrode_interface_new (J24.16)
A_IN8P: 02_AFE (U1.A1), 03_electrode_interface_new (J24.15)
ADS_A_DR: 02_AFE (U1.D6), 04_gap_interface (J4.22 J6.22)
ADS_B_DR: 02_AFE (U2.D6), 04_gap_interface (J4.23 J6.23)
B_IN1N: 02_AFE (U2.H2), 03_electrode_interface_new (J24.27)
B_IN1P: 02_AFE (U2.H1), 03_electrode_interface_new (J24.28)
B_IN2N: 02_AFE (U2.G2), 03_electrode_interface_new (J24.29)
B_IN2P: 02_AFE (U2.G1), 03_electrode_interface_new (J24.30)
B_IN3N: 02_AFE (U2.F2), 03_electrode_interface_new (J24.31)
B_IN3P: 02_AFE (U2.F1), 03_electrode_interface_new (J24.32)
B_IN4N: 02_AFE (U2.E2), 03_electrode_interface_new (J24.33)
B_IN4P: 02_AFE (U2.E1), 03_electrode_interface_new (J24.34)
B_IN5N: 02_AFE (U2.D2), 03_electrode_interface_new (J24.35)
B_IN5P: 02_AFE (U2.D1), 03_electrode_interface_new (J24.36)
B_IN6N: 02_AFE (U2.C2), 03_electrode_interface_new (J24.37)
B_IN6P: 02_AFE (U2.C1), 03_electrode_interface_new (J24.38)
B_IN7N: 02_AFE (U2.B2), 03_electrode_interface_new (J24.39)
B_IN7P: 02_AFE (U2.B1), 03_electrode_interface_new (J24.40)
B_IN8N: 02_AFE (U2.A2), 03_electrode_interface_new (J24.41)
B_IN8P: 02_AFE (U2.A1), 03_electrode_interface_new (J24.42)
BIAS: 02_AFE (6 pins), 04_gap_interface (J3.32 J5.32), 03_electrode_interface_new (11 pins)
CLK_EXT: 02_AFE (U1.G8 U2.G8 Y1.2), 04_gap_interface (J3.28 J5.28)
I2C_A_SCL: 04_gap_interface (J4.36 J6.36), 03_electrode_interface_new (5 pins)
I2C_A_SDA: 04_gap_interface (J4.35 J6.35), 03_electrode_interface_new (5 pins)
NetJ24_43: 02_AFE (R10.1), 03_electrode_interface_new (J24.43)
nRF_P0.04: 02_AFE (R35.2), 04_gap_interface (J3.20 J5.20)
nRF_P0.07/AMUX: 02_AFE (R36.2), 04_gap_interface (J3.26 J5.26)
nRF_P0.12_GAP_GPIO64: 04_gap_interface (J3.12 J5.12), 03_electrode_interface_new (J24.25 TP_GPIO64.48 TP_GPIO64_1.48)
nRF_P0.31: 01_power (U6.B2), 04_gap_interface (J3.2 J5.2)
nRF_P1.00_GAP_GPIO60: 02_AFE (U1.G7 U2.G7), 04_gap_interface (J3.4 J5.4)
nRF_P1.01_GAP_GPIO61: 02_AFE (R5.1), 04_gap_interface (J3.6 J5.6)
nRF_P1.09_GAP_GPIO62: 02_AFE (R12.1), 04_gap_interface (J3.8 J5.8)
nRF_P1.11_GAP_GPIO63: 04_gap_interface (J3.10 J5.10), 03_electrode_interface_new (J24.24 TP_GPIO63.47 TP_GPIO63_1.47)
RLDOUT: 02_AFE (C21.2 R1.2 U1.A3 U1.B3), 03_electrode_interface_new (J24.26)
SPI_A_CLK: 02_AFE (U1.F8 U2.F8), 04_gap_interface (J4.31 J6.31)
SPI_A_CS: 02_AFE (R11.1), 04_gap_interface (J4.28 J6.28)
SPI_A_MISO: 02_AFE (U1.E8 U2.E8), 04_gap_interface (J4.34 J6.34)
SPI_A_MOSI: 02_AFE (U1.H8 U2.H8), 04_gap_interface (J4.29 J6.29)

## Assembly variants
Bipolar_supply: not fitted R9 R32 R34 R35 R36